# EAGLE schematic machine-controller (EAGLE 5.10)
WV: 10V

## Sheet 1 of 8
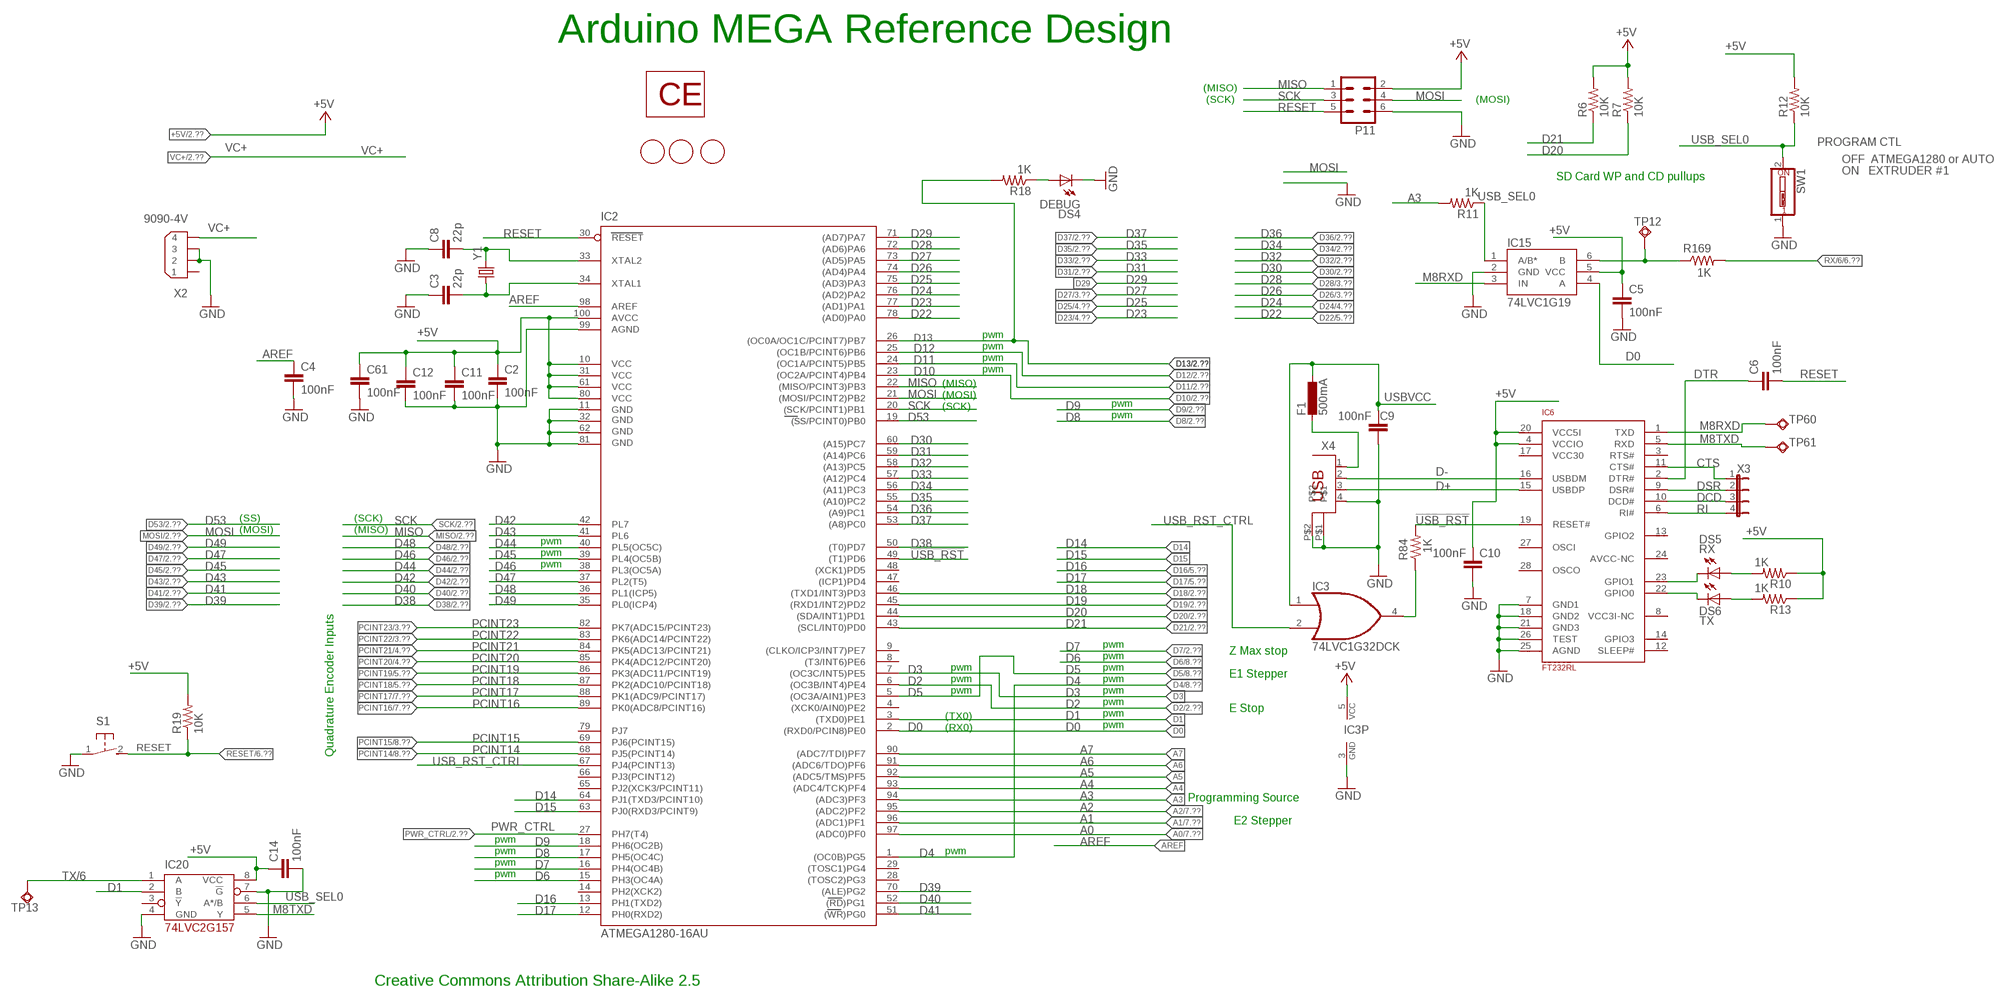
[diagram p0: schematic, sheet 1]

### Parts
C2  100nF  CAP0805  [0805]
C3  22p  CAP0805  [0805]
C4  100nF  CAP0805  [0805]
C5  100nF  CAP0805  [0805]
C6  100nF  CAP0805  [0805]
C8  22p  CAP0805  [0805]
C9  100nF  CAP0805  [0805]
C10  100nF  CAP0805  [0805]
C11  100nF  CAP0805  [0805]
C12  100nF  CAP0805  [0805]
C14  100nF  CAP0805  [0805]
C61  100nF  CAP0805  [0805]
DS4  DEBUG  LED0805  [LED-0805]
DS5  RX  LED0805  [LED-0805]
DS6  TX  LED0805  [LED-0805]
F1  500mA  L-EUL1812  [L1812]
IC2  ATMEGA1280-16AU  [TQFP100]
IC3  74LVC1G32DCK  [SC70-5]
IC6  FT232RL  [SSOP28]
IC15  74LVC1G19  [SC70-6]
IC20  74LVC2G157  [DCU_R-PDSO-G8]
P11  ML6  [ML6]
R6  10K  RESISTOR  [0805]
R7  10K  RESISTOR  [0805]
R10  1K  RESISTOR  [0805]
R11  1K  RESISTOR  [0805]
R12  10K  RESISTOR  [0805]
R13  1K  RESISTOR  [0805]
R18  1K  RESISTOR  [0805]
R19  10K  RESISTOR  [0805]
R84  1K  RESISTOR  [0805]
R169  1K  RESISTOR  [0805]
S1  31-XX  [B3F-31XX]
SW1  SW_DIP-1  [EDG-01]
TP12  TPSQTP09R  [TP09R]
TP13  TPSQTP09R  [TP09R]
TP60  TPSQTP09R  [TP09R]
TP61  TPSQTP09R  [TP09R]
U$3  FIDUCIALMOUNT  [FIDUCIA-MOUNT]
U$8  FIDUCIALMOUNT  [FIDUCIA-MOUNT]
U$9  FIDUCIALMOUNT  [FIDUCIA-MOUNT]
U$10  CE  [CE-COPPER]
X2  9090-4V  [9090-4V]
X3  JP4E  [JP4]
X4  PN61729  [PN61729]
Y1  CRYSTALHC49UP  [HC49UP]

### Nets
!USB_RST: IC2.49((T1)PD6) IC6.19(RESET#) R84.2
+5V [5V_power]: C2.1 C5.1 C10.2 C11.1 C12.1 C14.1 C61.1 IC2.10(VCC) IC2.31(VCC1) IC2.61(VCC2) IC2.80(VCC3) IC2.100(AVCC) IC3.5(VCC) IC6.4(VCCIO) IC6.20(VCC5I) IC15.5(VCC) IC20.8(VCC) P11.2 R6.2 R7.2 R10.1 R12.2 R13.1 R19.2 ; also sheet 2,3,4,5,6,7,8
A0: IC2.97((ADC0)PF0) ; also sheet 7
A1: IC2.96((ADC1)PF1) ; also sheet 7
A2: IC2.95((ADC2)PF2) ; also sheet 7
A3: IC2.94((ADC3)PF3) R11.2
A4: IC2.93((ADC4/TCK)PF4)
A5: IC2.92((ADC5/TMS)PF5)
A6: IC2.91((ADC6/TDO)PF6)
A7: IC2.90((ADC7/TDI)PF7)
AREF: C4.1 IC2.98(AREF)
CTS: IC6.11(CTS#) X3.1
D0: IC2.2((RXD0/PCIN8)PE0) IC15.4(A)
D1: IC2.3((TXD0)PE1) IC20.2(B)
D2: IC2.6((OC3B/INT4)PE4) ; also sheet 2
D3: IC2.7((OC3C/INT5)PE5)
D4: IC2.1((OC0B)PG5) ; also sheet 8
D5: IC2.5((OC3A/AIN1)PE3) ; also sheet 8
D6: IC2.15(PH3(OC4A)) ; also sheet 8
D7: IC2.16(PH4(OC4B)) ; also sheet 2
D8: IC2.17(PH5(OC4C)) ; also sheet 2
D9: IC2.18(PH6(OC2B)) ; also sheet 2
D10: IC2.23((OC2A/PCINT4)PB4) ; also sheet 2
D11: IC2.24((OC1A/PCINT5)PB5) ; also sheet 2
D12: IC2.25((OC1B/PCINT6)PB6) ; also sheet 2
D13: IC2.26((OC0A/OC1C/PCINT7)PB7) R18.2 ; also sheet 2
D14: IC2.64(PJ1(TXD3/PCINT10))
D15: IC2.63(PJ0(RXD3/PCINT9))
D16: IC2.13(PH1(TXD2)) ; also sheet 5
D17: IC2.12(PH0(RXD2)) ; also sheet 5
D18: IC2.46((TXD1/INT3)PD3) ; also sheet 2
D19: IC2.45((RXD1/INT2)PD2) ; also sheet 2
D20: IC2.44((SDA/INT1)PD1) R7.1 ; also sheet 2
D21: IC2.43((SCL/INT0)PD0) R6.1 ; also sheet 2
D22: IC2.78((AD0)PA0) ; also sheet 5
D23: IC2.77((AD1)PA1) ; also sheet 4
D24: IC2.76((AD2)PA2) ; also sheet 4
D25: IC2.75((AD3)PA3) ; also sheet 4
D26: IC2.74((AD4)PA4) ; also sheet 3
D27: IC2.73((AD5)PA5) ; also sheet 3
D28: IC2.72((AD6)PA6) ; also sheet 3
D29: IC2.71((AD7)PA7)
D30: IC2.60((A15)PC7) ; also sheet 2
D31: IC2.59((A14)PC6) ; also sheet 2
D32: IC2.58((A13)PC5) ; also sheet 2
D33: IC2.57((A12)PC4) ; also sheet 2
D34: IC2.56((A11)PC3) ; also sheet 2
D35: IC2.55((A10)PC2) ; also sheet 2
D36: IC2.54((A9)PC1) ; also sheet 2
D37: IC2.53((A8)PC0) ; also sheet 2
D38: IC2.50((T0)PD7) ; also sheet 2
D39: IC2.70((ALE)PG2) ; also sheet 2
D40: IC2.52((RD)PG1) ; also sheet 2
D41: IC2.51((WR)PG0) ; also sheet 2
D42: IC2.42(PL7) ; also sheet 2
D43: IC2.41(PL6) ; also sheet 2
D44: IC2.40(PL5(OC5C)) ; also sheet 2
D45: IC2.39(PL4(OC5B)) ; also sheet 2
D46: IC2.38(PL3(OC5A)) ; also sheet 2
D47: IC2.37(PL2(T5)) ; also sheet 2
D48: IC2.36(PL1(ICP5)) ; also sheet 2
D49: IC2.35(PL0(ICP4)) ; also sheet 2
D53: IC2.19((SS/PCINT0)PB0) ; also sheet 2
D+: IC6.15(USBDP) X4.3
D-: IC6.16(USBDM) X4.2
DCD: IC6.10(DCD#) X3.3
DSR: IC6.9(DSR#) X3.2
DTR: C6.1 IC6.2(DTR#)
GND [power]: C2.2 C3.1 C4.2 C5.2 C8.1 C9.1 C10.1 C11.2 C12.2 C14.2 C61.2 DS4.C IC2.11(GND) IC2.32(GND1) IC2.62(GND2) IC2.81(GND3) IC2.99(AGND) IC3.3(GND) IC6.7(GND1) IC6.18(GND2) IC6.21(GND3) IC6.25(AGND) IC6.26(TEST) IC15.2(GND) IC20.4(GND) IC20.7(!G) P11.6 S1.1(P) SW1.1 X2.2 X2.3 X4.4 X4.P$1 X4.P$2 ; also sheet 2,3,4,5,6,7,8
M8RXD: IC6.1(TXD) IC15.3(IN) TP60.TP
M8TXD: IC6.5(RXD) IC20.5(Y) TP61.TP
MISO: IC2.22((MISO/PCINT3)PB3) P11.1 ; also sheet 2
MOSI: IC2.21((MOSI/PCINT2)PB2) P11.4 ; also sheet 2
N$6: C3.2 IC2.34(XTAL1) Y1.1
N$7: C8.2 IC2.33(XTAL2) Y1.2
N$8: DS4.A R18.1
N$15: DS5.C IC6.23(GPIO1)
N$53: DS6.C IC6.22(GPIO0)
N$54: DS5.A R10.2
N$55: DS6.A R13.2
N$60 [usbvcc]: F1.2 X4.1
N$84: IC3.4(O) R84.1
N$101: IC15.6(B) R169.1 TP12.TP
PCINT14: IC2.68(PJ5(PCINT14)) ; also sheet 8
PCINT15: IC2.69(PJ6(PCINT15)) ; also sheet 8
PCINT16: IC2.89(PK0(ADC8/PCINT16)) ; also sheet 7
PCINT17: IC2.88(PK1(ADC9/PCINT17)) ; also sheet 7
PCINT18: IC2.87(PK2(ADC10/PCINT18)) ; also sheet 5
PCINT19: IC2.86(PK3(ADC11/PCINT19)) ; also sheet 5
PCINT20: IC2.85(PK4(ADC12/PCINT20)) ; also sheet 4
PCINT21: IC2.84(PK5(ADC13/PCINT21)) ; also sheet 4
PCINT22: IC2.83(PK6(ADC14/PCINT22)) ; also sheet 3
PCINT23: IC2.82(PK7(ADC15/PCINT23)) ; also sheet 3
PWR_CTRL: IC2.27(PH7(T4)) ; also sheet 2
RESET: C6.2 IC2.30(RESET) P11.5 R19.1 S1.2(S) ; also sheet 6
RI: IC6.6(RI#) X3.4
RX/6: R169.2 ; also sheet 6
SCK: IC2.20((SCK/PCINT1)PB1) P11.3 ; also sheet 2
TX/6: IC20.1(A) TP13.TP ; also sheet 6
USB_RST_CTRL: IC2.67(PJ4(PCINT13)) IC3.2(I1)
USB_SEL0: IC15.1(A/B*) IC20.6(A*/B) R11.1 R12.1 SW1.2
USBVCC [usbvcc]: C9.2 F1.1 IC3.1(I0)
VC+ [12V_power]: X2.4 ; also sheet 2,3,4,5,6,7,8
Unconnected: IC2.4((XCK0/AIN0)PE2) IC2.8((T3/INT6)PE6) IC2.9((CLKO/ICP3/INT7)PE7) IC2.14(PH2(XCK2)) IC2.28((TOSC2)PG3) IC2.29((TOSC1)PG4) IC2.47((ICP1)PD4) IC2.48((XCK1)PD5) IC2.65(PJ2(XCK3/PCINT11)) IC2.66(PJ3(PCINT12)) IC2.79(PJ7) IC6.3(RTS#) IC6.8(VCC3I-NC) IC6.12(SLEEP#) IC6.13(GPIO2) IC6.14(GPIO3) IC6.24(AVCC-NC) IC6.27(OSCI) IC6.28(OSCO) IC20.3(!Y) X2.1

### Notes on the sheet
- Arduino MEGA Reference Design
- (MISO)
- (SCK) | (MOSI)
- PROGRAM CTL
- OFF  ATMEGA1280 or AUTO
- ON   EXTRUDER #1
- SD Card WP and CD pullups
- pwm
- pwm
- pwm
- pwm
- (MISO)
- (MOSI)
- (SCK) | pwm
- pwm
- (SS) | (SCK)
- (MOSI) | (MISO)
- pwm
- pwm
- pwm
- pwm
- Z Max stop
- pwm
- pwm | pwm
- E1 Stepper
- pwm | pwm
- pwm | pwm
- pwm
- E Stop
- (TX0) | pwm
- (RX0) | pwm
- Quadrature Encoder Inputs
- Programming Source
- E2 Stepper
- pwm
- pwm | pwm
- pwm
- pwm
- Creative Commons Attribution Share-Alike 2.5

## Sheet 2 of 8
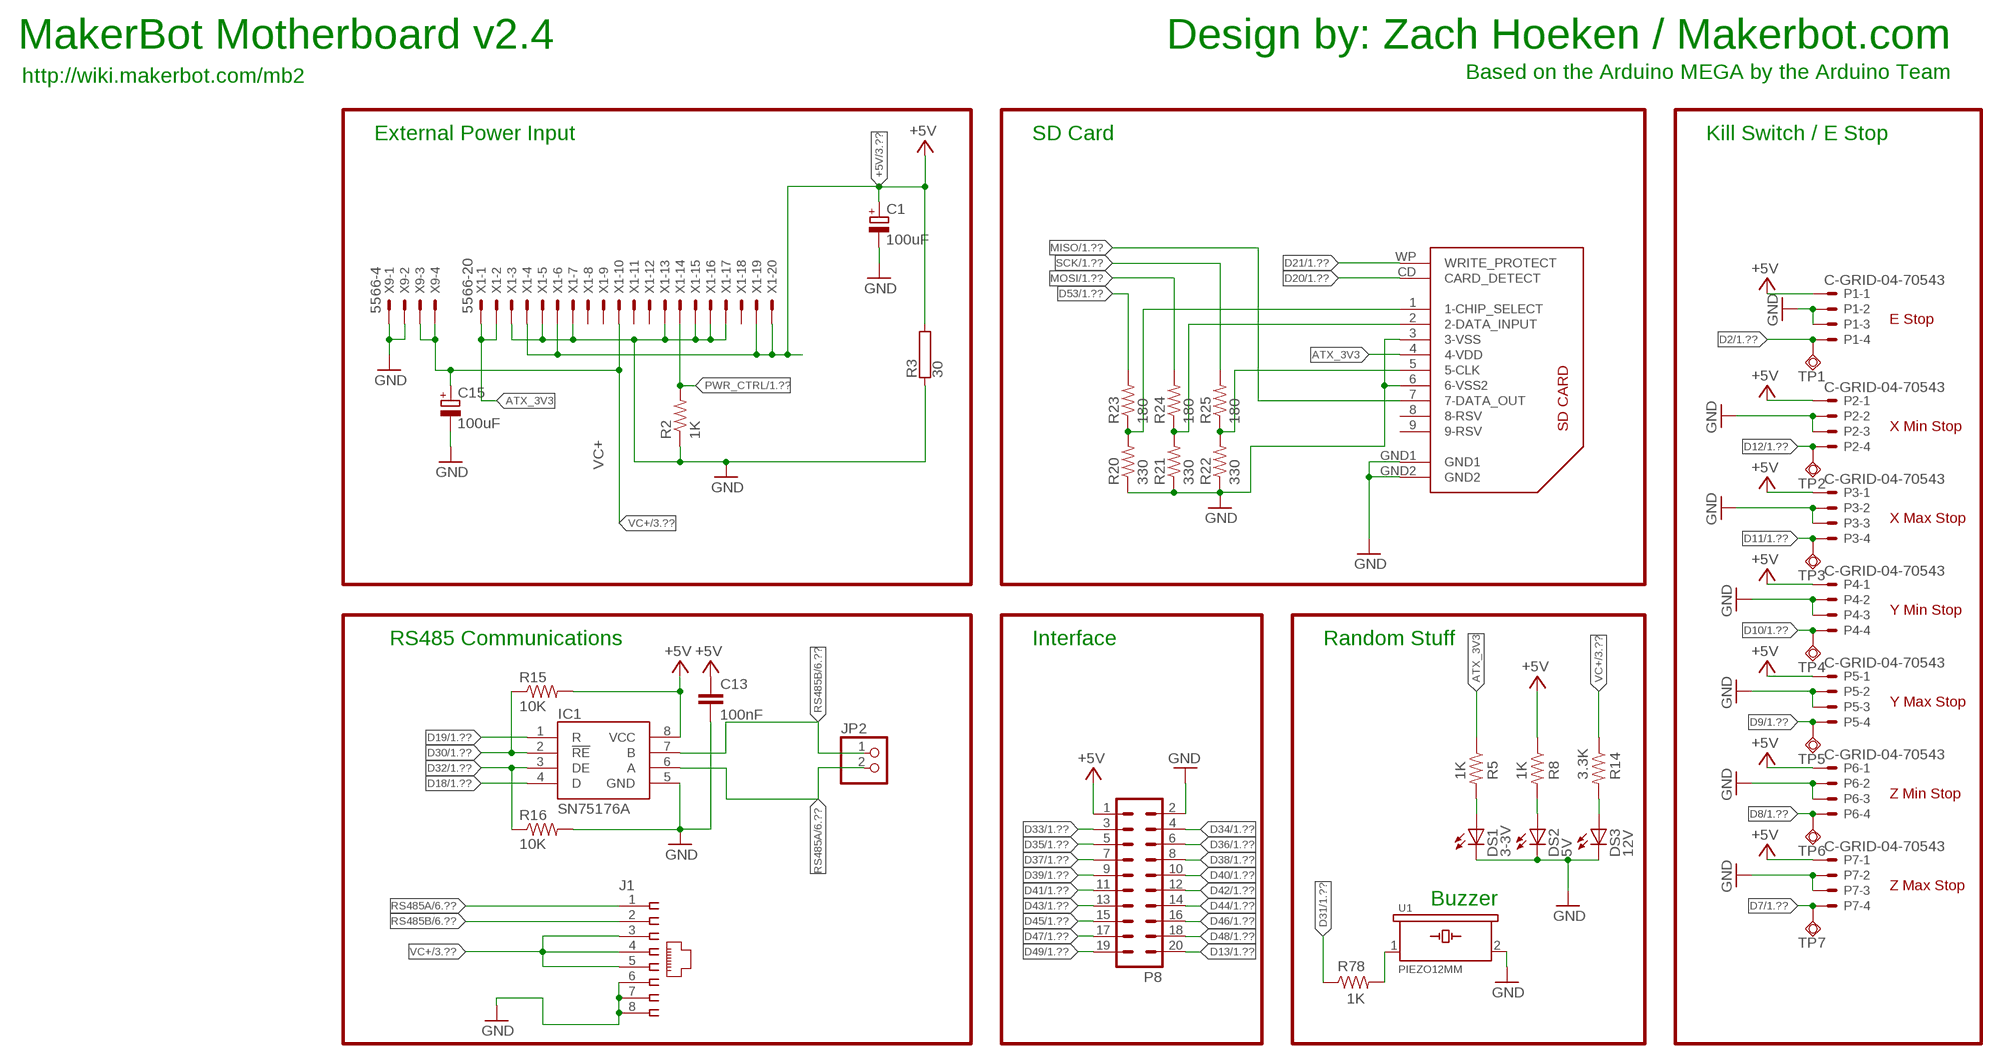
[diagram p1: schematic, sheet 2]

### Parts
C1  100uF  CPOL-EUE3.5-8  [E3,5-8]
C13  100nF  CAP0805  [0805]
C15  100uF  CPOL-EUE3.5-8  [E3,5-8]
DS1  3-3V  LED0805  [LED-0805]
DS2  5V  LED0805  [LED-0805]
DS3  12V  LED0805  [LED-0805]
IC1  SN75176A  SN75176ASOIC  [SO08]
J1  556416-1  [556416-1]
JP2  PINHD-1X2  [1X02]
P1  C-GRID-04-70543  [70543-04]
P2  C-GRID-04-70543  [70543-04]
P3  C-GRID-04-70543  [70543-04]
P4  C-GRID-04-70543  [70543-04]
P5  C-GRID-04-70543  [70543-04]
P6  C-GRID-04-70543  [70543-04]
P7  C-GRID-04-70543  [70543-04]
P8  ML20  [ML20]
R2  1K  RESISTOR  [0805]
R3  30  RKH206-8  [KH206-8]
R5  1K  RESISTOR  [0805]
R8  1K  RESISTOR  [0805]
R14  3.3K  RESISTOR  [0805]
R15  10K  RESISTOR  [0805]
R16  10K  RESISTOR  [0805]
R20  330  RESISTOR  [0805]
R21  330  RESISTOR  [0805]
R22  330  RESISTOR  [0805]
R23  180  RESISTOR  [0805]
R24  180  RESISTOR  [0805]
R25  180  RESISTOR  [0805]
R78  1K  RESISTOR  [0805]
TP1  TPSQTP09R  [TP09R]
TP2  TPSQTP09R  [TP09R]
TP3  TPSQTP09R  [TP09R]
TP4  TPSQTP09R  [TP09R]
TP5  TPSQTP09R  [TP09R]
TP6  TPSQTP09R  [TP09R]
TP7  TPSQTP09R  [TP09R]
U1  PIEZO12MM  [AUDIO12MM]
U$13  SDCARD  [3M-SDCARD]
X1  5566-20  [5566-20]
X9  5566-4  [5566-4]

### Nets
+5V [5V_power]: C1.+ C13.1 IC1.8(VCC) P1.1 P2.1 P3.1 P4.1 P5.1 P6.1 P7.1 P8.1 R3.2 R8.1 R15.2 X1.4 X1.6 X1.19 X1.20 ; also sheet 1,3,4,5,6,7,8
ATX_3V3: R5.1 U$13.4(4-VDD) X1.1 X1.2
D2: P1.4 TP1.TP ; also sheet 1
D7: P7.4 TP7.TP ; also sheet 1
D8: P6.4 TP6.TP ; also sheet 1
D9: P5.4 TP5.TP ; also sheet 1
D10: P4.4 TP4.TP ; also sheet 1
D11: P3.4 TP3.TP ; also sheet 1
D12: P2.4 TP2.TP ; also sheet 1
D13: P8.20 ; also sheet 1
D18: IC1.4(D) ; also sheet 1
D19: IC1.1(R) ; also sheet 1
D20: U$13.CD(CARD_DETECT) ; also sheet 1
D21: U$13.WP(WRITE_PROTECT) ; also sheet 1
D30: IC1.2(!RE) R15.1 ; also sheet 1
D31: R78.1 ; also sheet 1
D32: IC1.3(DE) R16.1 ; also sheet 1
D33: P8.3 ; also sheet 1
D34: P8.4 ; also sheet 1
D35: P8.5 ; also sheet 1
D36: P8.6 ; also sheet 1
D37: P8.7 ; also sheet 1
D38: P8.8 ; also sheet 1
D39: P8.9 ; also sheet 1
D40: P8.10 ; also sheet 1
D41: P8.11 ; also sheet 1
D42: P8.12 ; also sheet 1
D43: P8.13 ; also sheet 1
D44: P8.14 ; also sheet 1
D45: P8.15 ; also sheet 1
D46: P8.16 ; also sheet 1
D47: P8.17 ; also sheet 1
D48: P8.18 ; also sheet 1
D49: P8.19 ; also sheet 1
D53: R23.2 ; also sheet 1
GND [power]: C1.- C13.2 C15.- DS1.C DS2.C DS3.C IC1.5(GND) J1.6 J1.7 J1.8 P1.2 P1.3 P2.2 P2.3 P3.2 P3.3 P4.2 P4.3 P5.2 P5.3 P6.2 P6.3 P7.2 P7.3 P8.2 R2.1 R3.1 R16.2 R20.1 R21.1 R22.1 U1.2 U$13.3(3-VSS) U$13.6(6-VSS2) U$13.GND1 U$13.GND2 X1.3 X1.5 X1.7 X1.13 X1.15 X1.16 X1.17 X9.1 X9.2 ; also sheet 1,3,4,5,6,7,8
MISO: U$13.7(7-DATA_OUT) ; also sheet 1
MOSI: R24.2 ; also sheet 1
N$1: DS1.A R5.2
N$3: DS2.A R8.2
N$4: R22.2 R25.1 U$13.5(5-CLK)
N$5: R21.2 R24.1 U$13.2(2-DATA_INPUT)
N$10: DS3.A R14.2
N$11: R20.2 R23.1 U$13.1(1-CHIP_SELECT)
N$70: R78.2 U1.1
PWR_CTRL: R2.2 X1.14 ; also sheet 1
RS485A: IC1.6(A) J1.1 JP2.2 ; also sheet 6
RS485B: IC1.7(B) J1.2 JP2.1 ; also sheet 6
SCK: R25.2 ; also sheet 1
VC+ [12V_power]: C15.+ J1.3 J1.4 J1.5 R14.1 X1.10 X9.3 X9.4 ; also sheet 1,3,4,5,6,7,8
Unconnected: U$13.8(8-RSV) U$13.9(9-RSV) X1.8 X1.9 X1.11 X1.12 X1.18

### Notes on the sheet
- Design by: Zach Hoeken / Makerbot.com
- MakerBot Motherboard v2.4
- Based on the Arduino MEGA by the Arduino Team
- http://wiki.makerbot.com/mb2
- External Power Input | SD Card | Kill Switch / E Stop
- E Stop
- X Min Stop
- X Max Stop
- Y Min Stop
- RS485 Communications | Interface | Random Stuff
- Y Max Stop
- Z Min Stop
- Z Max Stop
- Buzzer

## Sheet 3 of 8
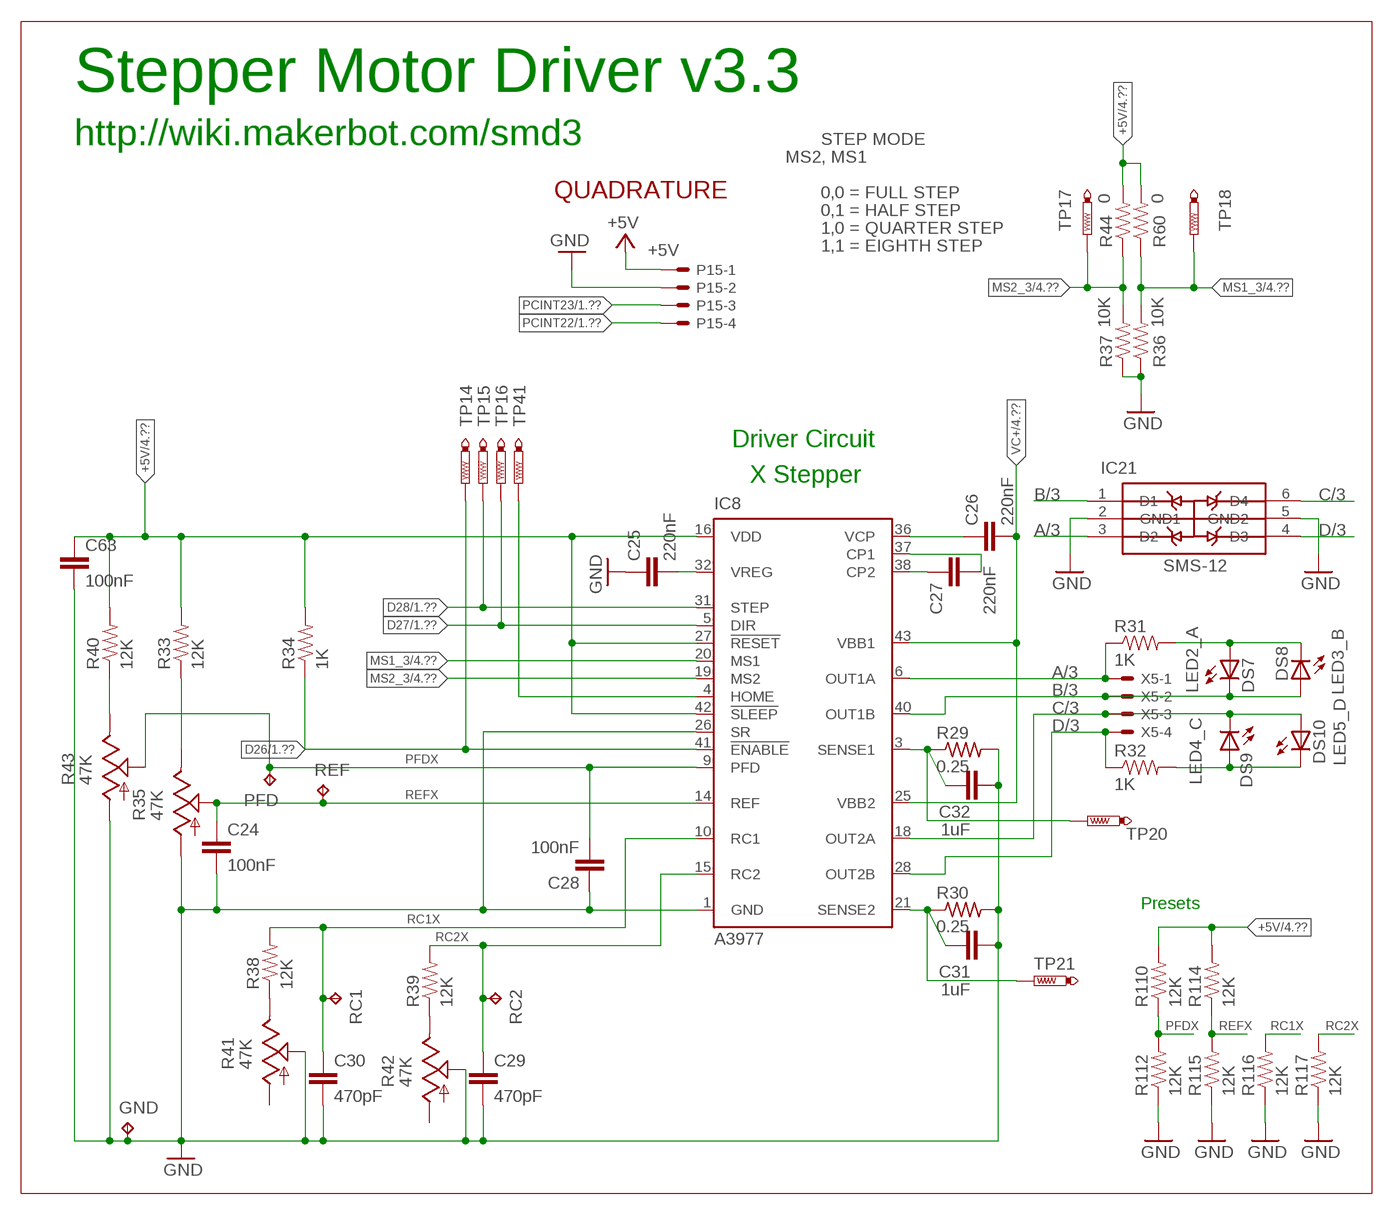
[diagram p2: schematic, sheet 3]

### Parts
C24  100nF  CAP0805  [0805]
C25  220nF  CAP0805  [0805]
C26  220nF  CAP0805  [0805]
C27  220nF  CAP0805  [0805]
C28  100nF  CAP0805  [0805]
C29  470pF  CAP0805  [0805]
C30  470pF  CAP0805  [0805]
C31  1uF  CAP0805  [0805]
C32  1uF  CAP0805  [0805]
C63  100nF  CAP0805  [0805]
DS7  LED2_A  LED0805  [LED-0805]
DS8  LED3_B  LED0805  [LED-0805]
DS9  LED4_C  LED0805  [LED-0805]
DS10  LED5_D  LED0805  [LED-0805]
GND  TPPAD1-13  [P1-13]
IC8  A3977  [PLCC44]
IC21  SMS-12  TVS-DIODE-ARRAY  [SOT23-6]
P15  C-GRID-04-70543  [70543-04]
PFD  TPPAD1-13  [P1-13]
R29  0.25  R-US_R2512  [R2512]
R30  0.25  R-US_R2512  [R2512]
R31  1K  RESISTOR  [0805]
R32  1K  RESISTOR  [0805]
R33  12K  RESISTOR  [0805]
R34  1K  RESISTOR  [0805]
R35  47K  TRIM_US-B25P  [B25P]
R36  10K  RESISTOR  [0805]
R37  10K  RESISTOR  [0805]
R38  12K  RESISTOR  [0805]
R39  12K  RESISTOR  [0805]
R40  12K  RESISTOR  [0805]
R41  47K  TRIM_US-B25P  [B25P]
R42  47K  TRIM_US-B25P  [B25P]
R43  47K  TRIM_US-B25P  [B25P]
R44  0  RESISTOR  [0805]
R60  0  RESISTOR  [0805]
R110  12K  RESISTOR  [0805]
R112  12K  RESISTOR  [0805]
R114  12K  RESISTOR  [0805]
R115  12K  RESISTOR  [0805]
R116  12K  RESISTOR  [0805]
R117  12K  RESISTOR  [0805]
RC1  TPPAD1-13  [P1-13]
RC2  TPPAD1-13  [P1-13]
REF  TPPAD1-13  [P1-13]
TP14  PTR1TP09R  [TP09R]
TP15  PTR1TP09R  [TP09R]
TP16  PTR1TP09R  [TP09R]
TP17  PTR1TP09R  [TP09R]
TP18  PTR1TP09R  [TP09R]
TP20  PTR1TP09R  [TP09R]
TP21  PTR1TP09R  [TP09R]
TP41  PTR1TP09R  [TP09R]
X5  KK-156-4  [KK-156-4]

### Nets
+5V [5V_power]: C63.1 IC8.16(VDD) IC8.27(!RESET) IC8.42(!SLEEP) P15.1 R33.2 R34.2 R40.2 R44.2 R60.2 R110.2 R114.2 ; also sheet 1,2,4,5,6,7,8
A/3 [power]: IC8.6(OUT1A) IC21.3(D2) R31.1 X5.1
B/3 [power]: DS7.C DS8.A IC8.40(OUT1B) IC21.1(D1) X5.2
C/3 [power]: DS9.C DS10.A IC8.18(OUT2A) IC21.6(D4) X5.3
D26: IC8.41(!ENABLE) R34.1 TP14.TP ; also sheet 1
D27: IC8.5(DIR) TP16.TP ; also sheet 1
D28: IC8.31(STEP) TP15.TP ; also sheet 1
D/3 [power]: IC8.28(OUT2B) IC21.4(D3) R32.1 X5.4
GND [power]: C24.2 C25.1 C28.1 C29.2 C30.2 C31.2 C32.2 C63.2 GND.TP IC8.1(GND) IC8.26(SR) IC21.2(GND1) IC21.5(GND2) P15.2 R29.2 R30.2 R35.A R36.1 R37.1 R41.S R42.S R43.A R112.1 R115.1 R116.1 R117.1 ; also sheet 1,2,4,5,6,7,8
MS1_3: IC8.20(MS1) R36.2 R60.1 TP18.TP ; also sheet 4
MS2_3: IC8.19(MS2) R37.2 R44.1 TP17.TP ; also sheet 4
N$14: DS7.A DS8.C R31.2
N$16: DS9.A DS10.C R32.2
N$17: R33.1 R35.E
N$18: C25.2 IC8.32(VREG)
N$19: C27.1 IC8.38(CP2)
N$20: C27.2 IC8.37(CP1)
N$21: C26.1 IC8.36(VCP)
N$22 [power]: C32.1 IC8.3(SENSE1) R29.1 TP20.TP
N$23 [power]: C31.1 IC8.21(SENSE2) R30.1 TP21.TP
N$25: R38.1 R41.E
N$26: R39.1 R42.E
N$29: R40.1 R43.E
N$77: IC8.4(HOME) TP41.TP
PCINT22: P15.4 ; also sheet 1
PCINT23: P15.3 ; also sheet 1
PFDX: C28.2 IC8.9(PFD) PFD.TP R43.S R110.1 R112.2
RC1X: C30.1 IC8.10(RC1) R38.2 R116.2 RC1.TP
RC2X: C29.1 IC8.15(RC2) R39.2 R117.2 RC2.TP
REFX: C24.1 IC8.14(REF) R35.S R114.1 R115.2 REF.TP
VC+ [12V_power]: C26.2 IC8.25(VBB2) IC8.43(VBB1) ; also sheet 1,2,4,5,6,7,8
Unconnected: R41.A R42.A

### Notes on the sheet
- Stepper Motor Driver v3.3
- http://wiki.makerbot.com/smd3 | STEP MODE
- MS2, MS1
- QUADRATURE | 0,0 = FULL STEP
- 0,1 = HALF STEP
- 1,0 = QUARTER STEP
- 1,1 = EIGHTH STEP
- Driver Circuit
- X Stepper
- Presets

## Sheet 4 of 8
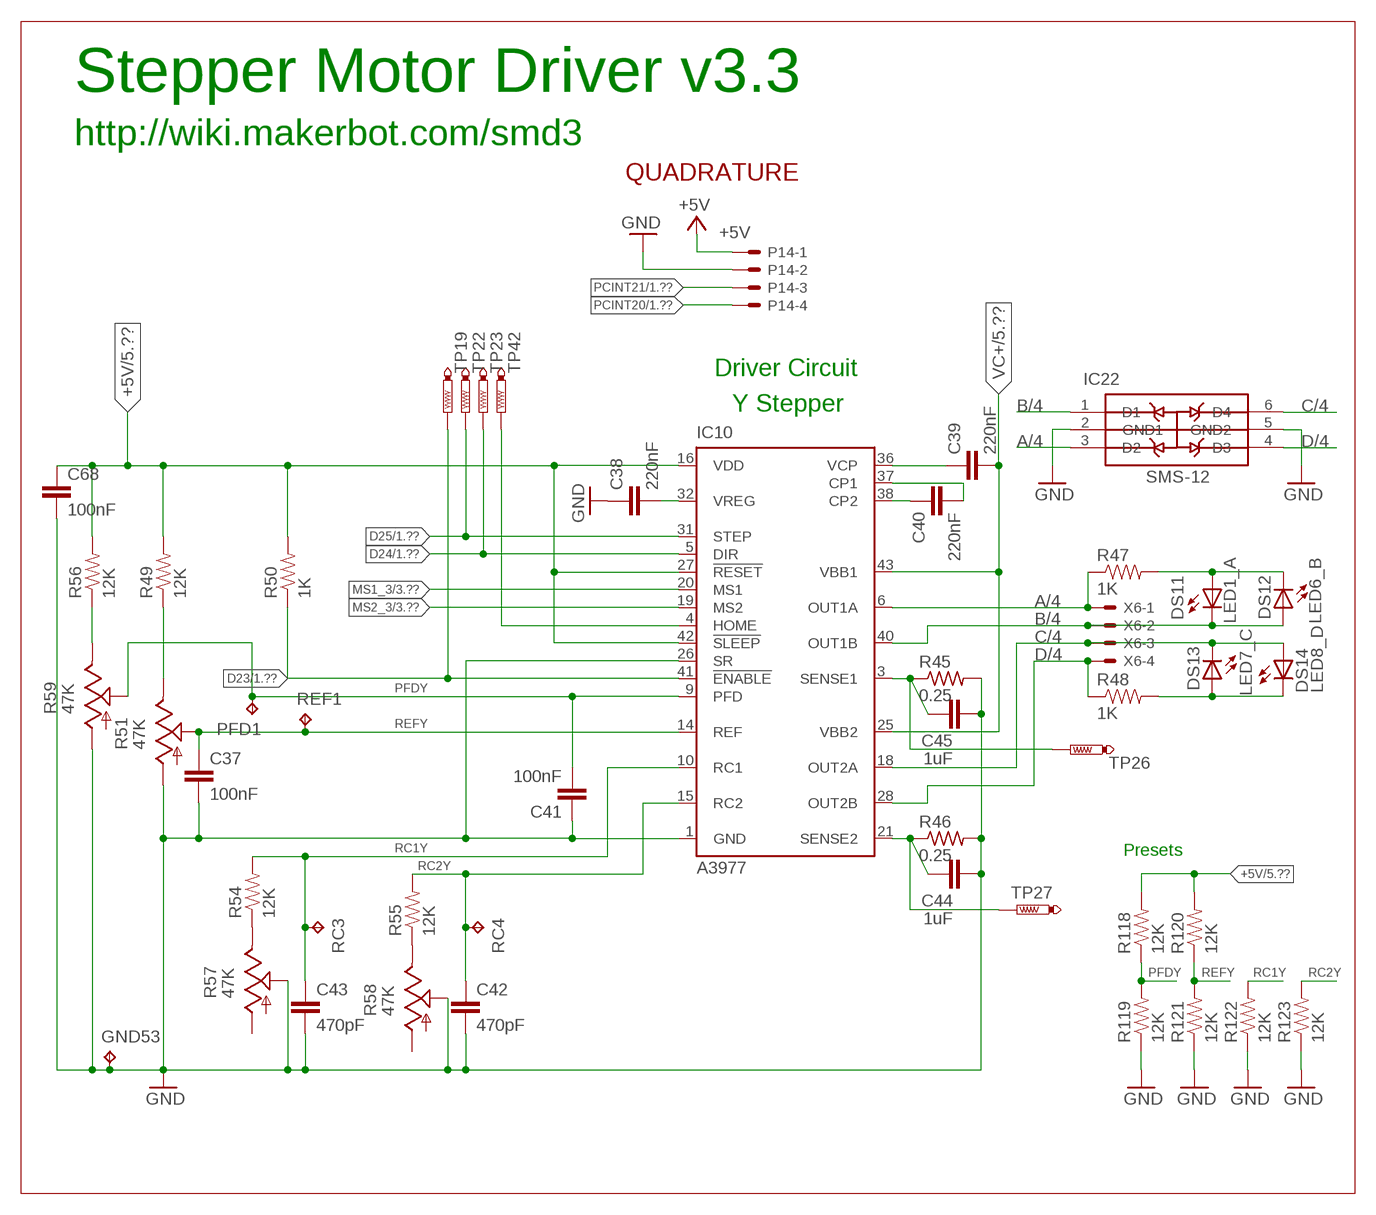
[diagram p3: schematic, sheet 4]

### Parts
C37  100nF  CAP0805  [0805]
C38  220nF  CAP0805  [0805]
C39  220nF  CAP0805  [0805]
C40  220nF  CAP0805  [0805]
C41  100nF  CAP0805  [0805]
C42  470pF  CAP0805  [0805]
C43  470pF  CAP0805  [0805]
C44  1uF  CAP0805  [0805]
C45  1uF  CAP0805  [0805]
C68  100nF  CAP0805  [0805]
DS11  LED1_A  LED0805  [LED-0805]
DS12  LED6_B  LED0805  [LED-0805]
DS13  LED7_C  LED0805  [LED-0805]
DS14  LED8_D  LED0805  [LED-0805]
GND53  TPPAD1-13  [P1-13]
IC10  A3977  [PLCC44]
IC22  SMS-12  TVS-DIODE-ARRAY  [SOT23-6]
P14  C-GRID-04-70543  [70543-04]
PFD1  TPPAD1-13  [P1-13]
R45  0.25  R-US_R2512  [R2512]
R46  0.25  R-US_R2512  [R2512]
R47  1K  RESISTOR  [0805]
R48  1K  RESISTOR  [0805]
R49  12K  RESISTOR  [0805]
R50  1K  RESISTOR  [0805]
R51  47K  TRIM_US-B25P  [B25P]
R54  12K  RESISTOR  [0805]
R55  12K  RESISTOR  [0805]
R56  12K  RESISTOR  [0805]
R57  47K  TRIM_US-B25P  [B25P]
R58  47K  TRIM_US-B25P  [B25P]
R59  47K  TRIM_US-B25P  [B25P]
R118  12K  RESISTOR  [0805]
R119  12K  RESISTOR  [0805]
R120  12K  RESISTOR  [0805]
R121  12K  RESISTOR  [0805]
R122  12K  RESISTOR  [0805]
R123  12K  RESISTOR  [0805]
RC3  TPPAD1-13  [P1-13]
RC4  TPPAD1-13  [P1-13]
REF1  TPPAD1-13  [P1-13]
TP19  PTR1TP09R  [TP09R]
TP22  PTR1TP09R  [TP09R]
TP23  PTR1TP09R  [TP09R]
TP26  PTR1TP09R  [TP09R]
TP27  PTR1TP09R  [TP09R]
TP42  PTR1TP09R  [TP09R]
X6  KK-156-4  [KK-156-4]

### Nets
+5V [5V_power]: C68.1 IC10.16(VDD) IC10.27(!RESET) IC10.42(!SLEEP) P14.1 R49.2 R50.2 R56.2 R118.2 R120.2 ; also sheet 1,2,3,5,6,7,8
A/4 [power]: IC10.6(OUT1A) IC22.3(D2) R47.1 X6.1
B/4 [power]: DS11.C DS12.A IC10.40(OUT1B) IC22.1(D1) X6.2
C/4 [power]: DS13.C DS14.A IC10.18(OUT2A) IC22.6(D4) X6.3
D23: IC10.41(!ENABLE) R50.1 TP19.TP ; also sheet 1
D24: IC10.5(DIR) TP23.TP ; also sheet 1
D25: IC10.31(STEP) TP22.TP ; also sheet 1
D/4 [power]: IC10.28(OUT2B) IC22.4(D3) R48.1 X6.4
GND [power]: C37.2 C38.1 C41.1 C42.2 C43.2 C44.2 C45.2 C68.2 GND53.TP IC10.1(GND) IC10.26(SR) IC22.2(GND1) IC22.5(GND2) P14.2 R45.2 R46.2 R51.A R57.S R58.S R59.A R119.1 R121.1 R122.1 R123.1 ; also sheet 1,2,3,5,6,7,8
MS1_3: IC10.20(MS1) ; also sheet 3
MS2_3: IC10.19(MS2) ; also sheet 3
N$32: DS11.A DS12.C R47.2
N$33: DS13.A DS14.C R48.2
N$34: R49.1 R51.E
N$35: C38.2 IC10.32(VREG)
N$36: C40.1 IC10.38(CP2)
N$37: C40.2 IC10.37(CP1)
N$38: C39.1 IC10.36(VCP)
N$39 [power]: C45.1 IC10.3(SENSE1) R45.1 TP26.TP
N$40 [power]: C44.1 IC10.21(SENSE2) R46.1 TP27.TP
N$42: R54.1 R57.E
N$43: R55.1 R58.E
N$46: R56.1 R59.E
N$78: IC10.4(HOME) TP42.TP
PCINT20: P14.4 ; also sheet 1
PCINT21: P14.3 ; also sheet 1
PFDY: C41.2 IC10.9(PFD) PFD1.TP R59.S R118.1 R119.2
RC1Y: C43.1 IC10.10(RC1) R54.2 R122.2 RC3.TP
RC2Y: C42.1 IC10.15(RC2) R55.2 R123.2 RC4.TP
REFY: C37.1 IC10.14(REF) R51.S R120.1 R121.2 REF1.TP
VC+ [12V_power]: C39.2 IC10.25(VBB2) IC10.43(VBB1) ; also sheet 1,2,3,5,6,7,8
Unconnected: R57.A R58.A

### Notes on the sheet
- Stepper Motor Driver v3.3
- http://wiki.makerbot.com/smd3
- QUADRATURE
- Driver Circuit
- Y Stepper
- Presets

## Sheet 5 of 8
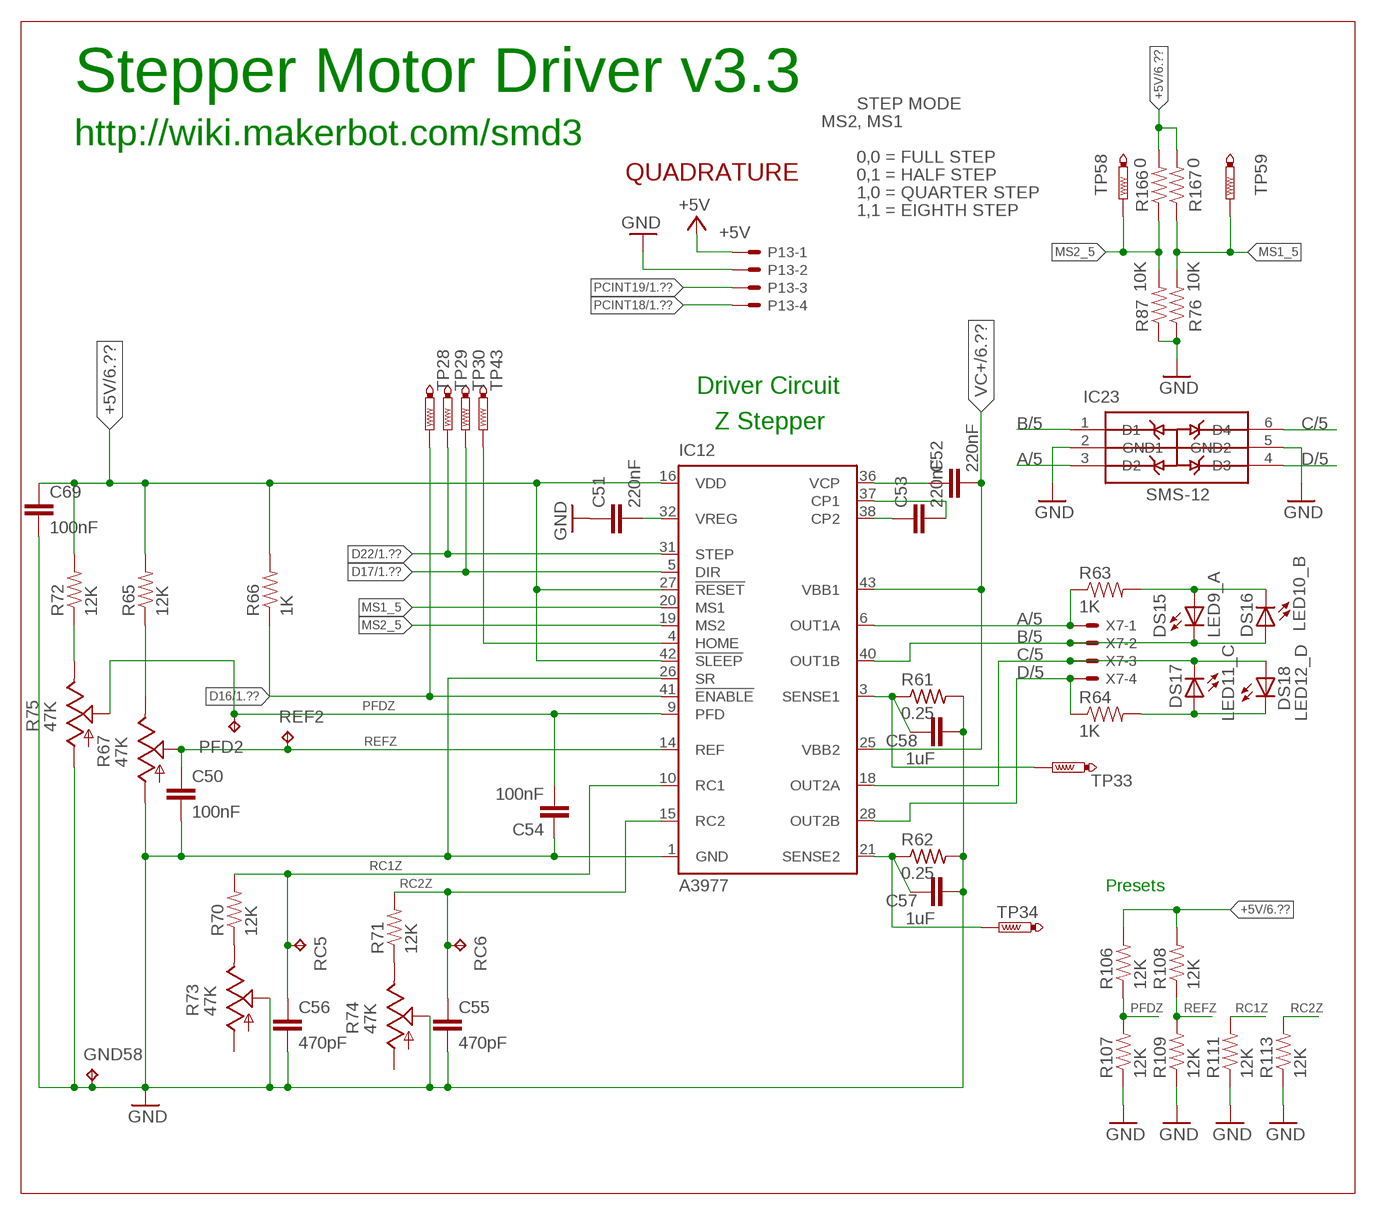
[diagram p4: schematic, sheet 5]

### Parts
C50  100nF  CAP0805  [0805]
C51  220nF  CAP0805  [0805]
C52  220nF  CAP0805  [0805]
C53  220nF  CAP0805  [0805]
C54  100nF  CAP0805  [0805]
C55  470pF  CAP0805  [0805]
C56  470pF  CAP0805  [0805]
C57  1uF  CAP0805  [0805]
C58  1uF  CAP0805  [0805]
C69  100nF  CAP0805  [0805]
DS15  LED9_A  LED0805  [LED-0805]
DS16  LED10_B  LED0805  [LED-0805]
DS17  LED11_C  LED0805  [LED-0805]
DS18  LED12_D  LED0805  [LED-0805]
GND58  TPPAD1-13  [P1-13]
IC12  A3977  [PLCC44]
IC23  SMS-12  TVS-DIODE-ARRAY  [SOT23-6]
P13  C-GRID-04-70543  [70543-04]
PFD2  TPPAD1-13  [P1-13]
R61  0.25  R-US_R2512  [R2512]
R62  0.25  R-US_R2512  [R2512]
R63  1K  RESISTOR  [0805]
R64  1K  RESISTOR  [0805]
R65  12K  RESISTOR  [0805]
R66  1K  RESISTOR  [0805]
R67  47K  TRIM_US-B25P  [B25P]
R70  12K  RESISTOR  [0805]
R71  12K  RESISTOR  [0805]
R72  12K  RESISTOR  [0805]
R73  47K  TRIM_US-B25P  [B25P]
R74  47K  TRIM_US-B25P  [B25P]
R75  47K  TRIM_US-B25P  [B25P]
R76  10K  RESISTOR  [0805]
R87  10K  RESISTOR  [0805]
R106  12K  RESISTOR  [0805]
R107  12K  RESISTOR  [0805]
R108  12K  RESISTOR  [0805]
R109  12K  RESISTOR  [0805]
R111  12K  RESISTOR  [0805]
R113  12K  RESISTOR  [0805]
R166  0  RESISTOR  [0805]
R167  0  RESISTOR  [0805]
RC5  TPPAD1-13  [P1-13]
RC6  TPPAD1-13  [P1-13]
REF2  TPPAD1-13  [P1-13]
TP28  PTR1TP09R  [TP09R]
TP29  PTR1TP09R  [TP09R]
TP30  PTR1TP09R  [TP09R]
TP33  PTR1TP09R  [TP09R]
TP34  PTR1TP09R  [TP09R]
TP43  PTR1TP09R  [TP09R]
TP58  PTR1TP09R  [TP09R]
TP59  PTR1TP09R  [TP09R]
X7  KK-156-4  [KK-156-4]

### Nets
+5V [5V_power]: C69.1 IC12.16(VDD) IC12.27(!RESET) IC12.42(!SLEEP) P13.1 R65.2 R66.2 R72.2 R106.2 R108.2 R166.2 R167.2 ; also sheet 1,2,3,4,6,7,8
A/5 [power]: IC12.6(OUT1A) IC23.3(D2) R63.1 X7.1
B/5 [power]: DS15.C DS16.A IC12.40(OUT1B) IC23.1(D1) X7.2
C/5 [power]: DS17.C DS18.A IC12.18(OUT2A) IC23.6(D4) X7.3
D16: IC12.41(!ENABLE) R66.1 TP28.TP ; also sheet 1
D17: IC12.5(DIR) TP30.TP ; also sheet 1
D22: IC12.31(STEP) TP29.TP ; also sheet 1
D/5 [power]: IC12.28(OUT2B) IC23.4(D3) R64.1 X7.4
GND [power]: C50.2 C51.1 C54.1 C55.2 C56.2 C57.2 C58.2 C69.2 GND58.TP IC12.1(GND) IC12.26(SR) IC23.2(GND1) IC23.5(GND2) P13.2 R61.2 R62.2 R67.A R73.S R74.S R75.A R76.1 R87.1 R107.1 R109.1 R111.1 R113.1 ; also sheet 1,2,3,4,6,7,8
MS1_5: IC12.20(MS1) R76.2 R167.1 TP59.TP
MS2_5: IC12.19(MS2) R87.2 R166.1 TP58.TP
N$49: DS15.A DS16.C R63.2
N$50: DS17.A DS18.C R64.2
N$51: R65.1 R67.E
N$52: C51.2 IC12.32(VREG)
N$56: C53.1 IC12.38(CP2)
N$57: C53.2 IC12.37(CP1)
N$58: C52.1 IC12.36(VCP)
N$59 [power]: C58.1 IC12.3(SENSE1) R61.1 TP33.TP
N$61 [power]: C57.1 IC12.21(SENSE2) R62.1 TP34.TP
N$63: R70.1 R73.E
N$64: R71.1 R74.E
N$67: R72.1 R75.E
N$82: IC12.4(HOME) TP43.TP
PCINT18: P13.4 ; also sheet 1
PCINT19: P13.3 ; also sheet 1
PFDZ: C54.2 IC12.9(PFD) PFD2.TP R75.S R106.1 R107.2
RC1Z: C56.1 IC12.10(RC1) R70.2 R111.2 RC5.TP
RC2Z: C55.1 IC12.15(RC2) R71.2 R113.2 RC6.TP
REFZ: C50.1 IC12.14(REF) R67.S R108.1 R109.2 REF2.TP
VC+ [12V_power]: C52.2 IC12.25(VBB2) IC12.43(VBB1) ; also sheet 1,2,3,4,6,7,8
Unconnected: R73.A R74.A

### Notes on the sheet
- Stepper Motor Driver v3.3
- STEP MODE
- MS2, MS1
- http://wiki.makerbot.com/smd3
- 0,0 = FULL STEP
- QUADRATURE | 0,1 = HALF STEP
- 1,0 = QUARTER STEP
- 1,1 = EIGHTH STEP
- Driver Circuit
- Z Stepper
- Presets

## Sheet 6 of 8
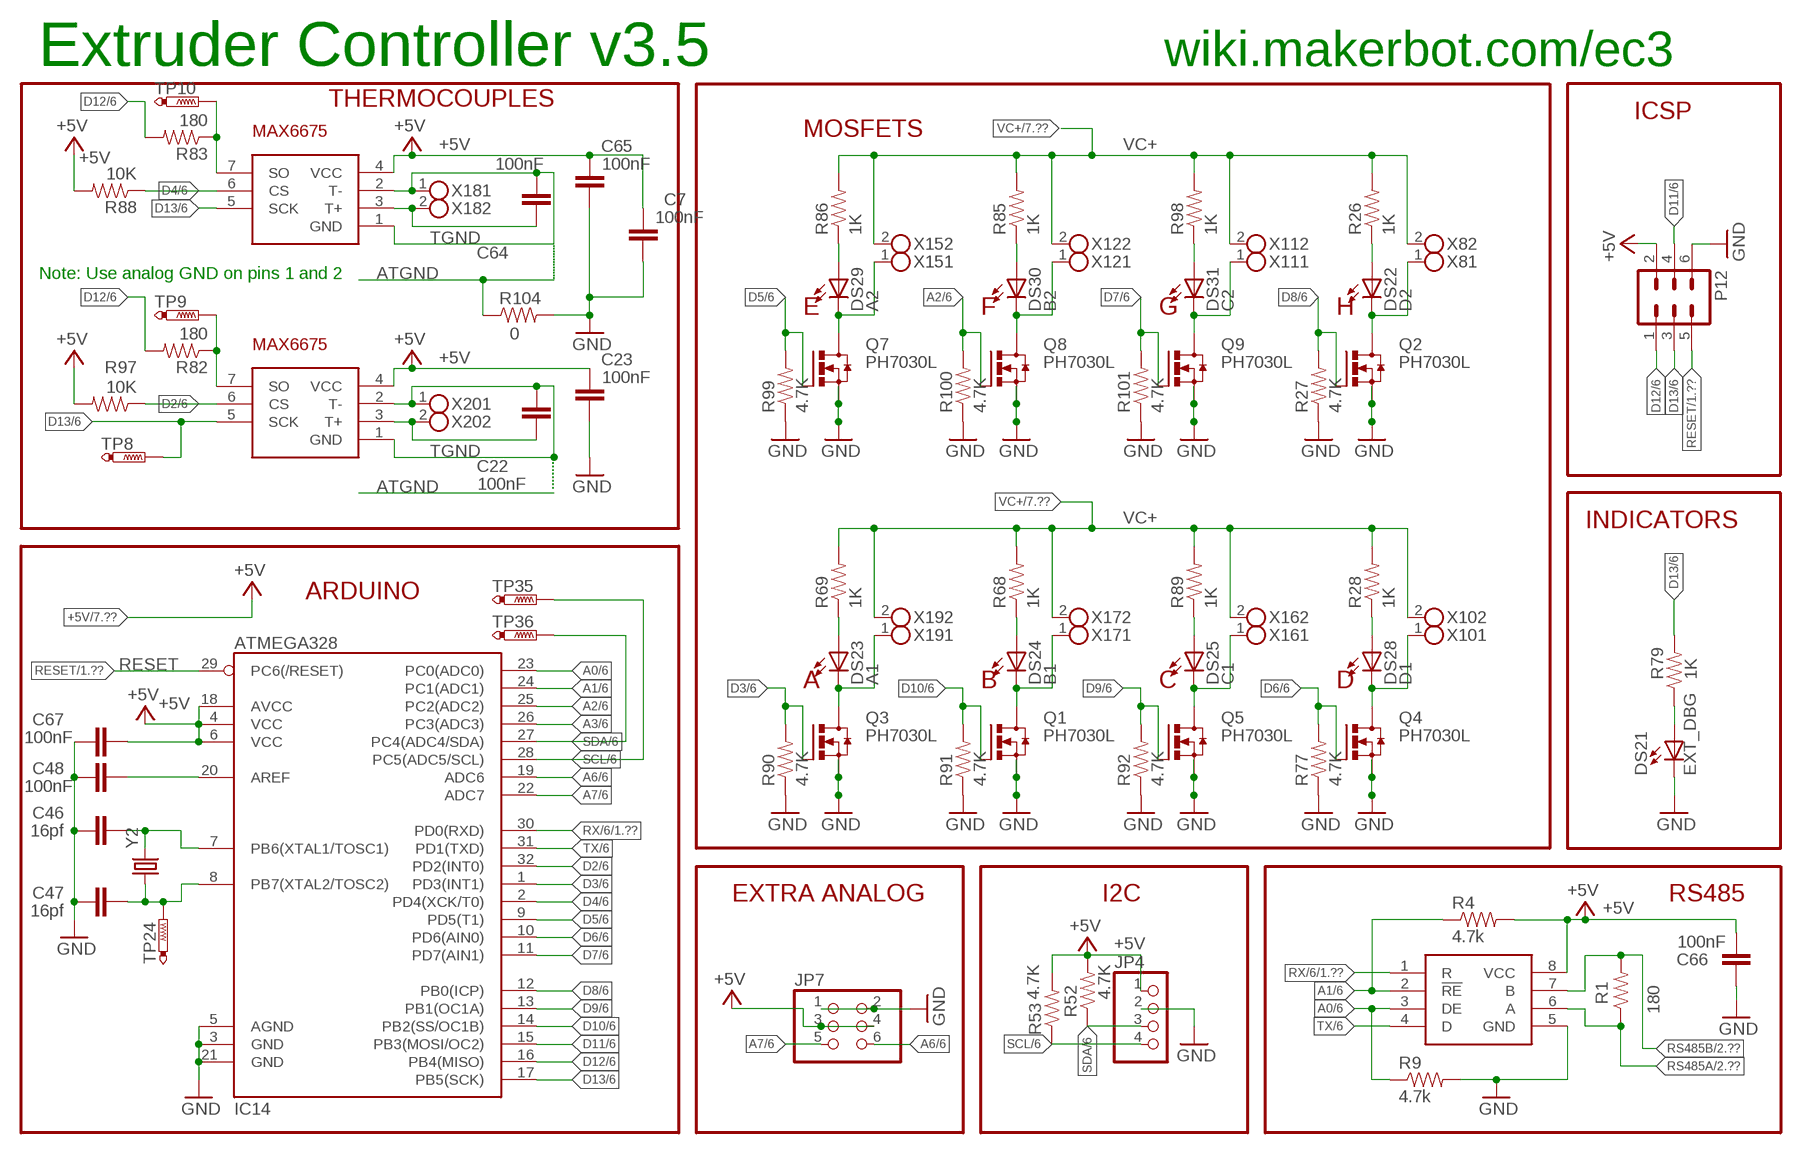
[diagram p5: schematic, sheet 6]

### Parts
C7  100nF  CAP0805  [0805]
C22  100nF  CAP0805  [0805]
C23  100nF  CAP0805  [0805]
C46  16pf  CAP0805  [0805]
C47  16pf  CAP0805  [0805]
C48  100nF  CAP0805  [0805]
C64  100nF  CAP0805  [0805]
C65  100nF  CAP0805  [0805]
C66  100nF  CAP0805  [0805]
C67  100nF  CAP0805  [0805]
DS21  EXT_DBG  LED0805  [LED-0805]
DS22  D2  LED0805  [LED-0805]
DS23  A1  LED0805  [LED-0805]
DS24  B1  LED0805  [LED-0805]
DS25  C1  LED0805  [LED-0805]
DS28  D1  LED0805  [LED-0805]
DS29  A2  LED0805  [LED-0805]
DS30  B2  LED0805  [LED-0805]
DS31  C2  LED0805  [LED-0805]
IC9  MAX6675  [SO08]
IC11  SN75176ASOIC  [SO08]
IC14  ATMEGA328  ATMEGA168  [TQFP32-08]
IC17  MAX6675  [SO08]
JP4  PINHD-1X4  [1X04]
JP7  PINHD-2X3  [2X03]
P12  ML6  [ML6]
Q1  PH7030L  [SOT669]
Q2  PH7030L  [SOT669]
Q3  PH7030L  [SOT669]
Q4  PH7030L  [SOT669]
Q5  PH7030L  [SOT669]
Q7  PH7030L  [SOT669]
Q8  PH7030L  [SOT669]
Q9  PH7030L  [SOT669]
R1  180  RESISTOR  [0805]
R4  4.7k  RESISTOR  [0805]
R9  4.7k  RESISTOR  [0805]
R26  1K  RESISTOR  [0805]
R27  4.7K  RESISTOR  [0805]
R28  1K  RESISTOR  [0805]
R52  4.7K  RESISTOR  [0805]
R53  4.7K  RESISTOR  [0805]
R68  1K  RESISTOR  [0805]
R69  1K  RESISTOR  [0805]
R77  4.7K  RESISTOR  [0805]
R79  1K  RESISTOR  [0805]
R82  180  RESISTOR  [0805]
R83  180  RESISTOR  [0805]
R85  1K  RESISTOR  [0805]
R86  1K  RESISTOR  [0805]
R88  10K  RESISTOR  [0805]
R89  1K  RESISTOR  [0805]
R90  4.7K  RESISTOR  [0805]
R91  4.7K  RESISTOR  [0805]
R92  4.7K  RESISTOR  [0805]
R97  10K  RESISTOR  [0805]
R98  1K  RESISTOR  [0805]
R99  4.7K  RESISTOR  [0805]
R100  4.7K  RESISTOR  [0805]
R101  4.7K  RESISTOR  [0805]
R104  0  RESISTOR  [0805]
TP8  PTR1TP09R  [TP09R]
TP9  PTR1TP09R  [TP09R]
TP10  PTR1TP09R  [TP09R]
TP24  PTR1TP09R  [TP09R]
TP35  PTR1TP09R  [TP09R]
TP36  PTR1TP09R  [TP09R]
X8  TERMBLK3_5X2  [TERMBLK3_5X2]
X10  TERMBLK3_5X2  [TERMBLK3_5X2]
X11  TERMBLK3_5X2  [TERMBLK3_5X2]
X12  TERMBLK3_5X2  [TERMBLK3_5X2]
X15  TERMBLK3_5X2  [TERMBLK3_5X2]
X16  TERMBLK3_5X2  [TERMBLK3_5X2]
X17  TERMBLK3_5X2  [TERMBLK3_5X2]
X18  TERMBLK3_5X2  [TERMBLK3_5X2]
X19  TERMBLK3_5X2  [TERMBLK3_5X2]
X20  TERMBLK3_5X2  [TERMBLK3_5X2]
Y2  CRYSTALHC49UP  [HC49UP]

### Nets
+5V [5V_power]: C7.2 C23.2 C65.2 C66.2 C67.2 IC9.4(VCC) IC11.8(VCC) IC14.4(VCC) IC14.6(VCC) IC14.18(AVCC) IC17.4(VCC) JP4.1 JP7.3 JP7.4 P12.2 R4.2 R52.2 R53.2 R88.2 R97.2 ; also sheet 1,2,3,4,5,7,8
A0/6: IC11.3(DE) IC14.23(PC0(ADC0)) R9.1
A1/6: IC11.2(!RE) IC14.24(PC1(ADC1)) R4.1
A2/6: IC14.25(PC2(ADC2)) Q8.4(G) R100.2
A3/6: IC14.26(PC3(ADC3))
A6/6: IC14.19(ADC6) JP7.6
A7/6: IC14.22(ADC7) JP7.5
APWR [power]: DS23.C Q3.MB(D) X19.1
APWR1 [power]: DS29.C Q7.MB(D) X15.1
ATGND: R104.1
BPWR [power]: DS24.C Q1.MB(D) X17.1
BPWR1 [power]: DS30.C Q8.MB(D) X12.1
CPWR [power]: DS25.C Q5.MB(D) X16.1
CPWR1 [power]: DS31.C Q9.MB(D) X11.1
D2/6: IC9.6(CS) IC14.32(PD2(INT0)) R97.1
D3/6: IC14.1(PD3(INT1)) Q3.4(G) R90.2
D4/6: IC14.2(PD4(XCK/T0)) IC17.6(CS) R88.1
D5/6: IC14.9(PD5(T1)) Q7.4(G) R99.2
D6/6: IC14.10(PD6(AIN0)) Q4.4(G) R77.2
D7/6: IC14.11(PD7(AIN1)) Q9.4(G) R101.2
D8/6: IC14.12(PB0(ICP)) Q2.4(G) R27.2
D9/6: IC14.13(PB1(OC1A)) Q5.4(G) R92.2
D10/6: IC14.14(PB2(SS/OC1B)) Q1.4(G) R91.2
D11/6: IC14.15(PB3(MOSI/OC2)) P12.4
D12/6: IC14.16(PB4(MISO)) P12.1 R82.2 R83.2
D13/6: IC9.5(SCK) IC14.17(PB5(SCK)) IC17.5(SCK) P12.3 R79.2 TP8.TP
DPWR [power]: DS28.C Q4.MB(D) X10.1
DPWR1 [power]: DS22.C Q2.MB(D) X8.1
GND [power]: C7.1 C23.1 C46.1 C47.1 C48.1 C65.1 C66.1 C67.1 DS21.C IC11.5(GND) IC14.3(GND) IC14.5(AGND) IC14.21(GND) JP4.2 JP7.1 JP7.2 P12.6 Q1.1(S) Q1.2(S) Q1.3(S) Q2.1(S) Q2.2(S) Q2.3(S) Q3.1(S) Q3.2(S) Q3.3(S) Q4.1(S) Q4.2(S) Q4.3(S) Q5.1(S) Q5.2(S) Q5.3(S) Q7.1(S) Q7.2(S) Q7.3(S) Q8.1(S) Q8.2(S) Q8.3(S) Q9.1(S) Q9.2(S) Q9.3(S) R9.2 R27.1 R77.1 R90.1 R91.1 R92.1 R99.1 R100.1 R101.1 R104.2 ; also sheet 1,2,3,4,5,7,8
N$12: DS29.A R86.1
N$31: DS23.A R69.1
N$48: DS24.A R68.1
N$68: DS22.A R26.1
N$69: DS28.A R28.1
N$72: DS30.A R85.1
N$73: C46.2 IC14.7(PB6(XTAL1/TOSC1)) Y2.2
N$74: C47.2 IC14.8(PB7(XTAL2/TOSC2)) TP24.TP Y2.1
N$75: DS21.A R79.1
N$76: C48.2 IC14.20(AREF)
N$81: IC9.7(SO) R82.1 TP9.TP
N$83: IC17.7(SO) R83.1 TP10.TP
N$96: C22.1 IC9.3(T+) X20.2
N$97: C64.1 IC17.3(T+) X18.2
N$98: DS25.A R89.1
N$99: DS31.A R98.1
RESET: IC14.29(PC6(/RESET)) P12.5 ; also sheet 1
RS485A: IC11.6(A) R1.1 ; also sheet 2
RS485B: IC11.7(B) R1.2 ; also sheet 2
RX/6: IC11.1(R) IC14.30(PD0(RXD)) ; also sheet 1
SCL/6: IC14.28(PC5(ADC5/SCL)) JP4.4 R53.1 TP35.TP
SDA/6: IC14.27(PC4(ADC4/SDA)) JP4.3 R52.1 TP36.TP
TGND: C22.2 C64.2 IC9.1(GND) IC9.2(T-) IC17.1(GND) IC17.2(T-) X18.1 X20.1
TX/6: IC11.4(D) IC14.31(PD1(TXD)) ; also sheet 1
VC+ [12V_power]: R26.2 R28.2 R68.2 R69.2 R85.2 R86.2 R89.2 R98.2 X8.2 X10.2 X11.2 X12.2 X15.2 X16.2 X17.2 X19.2 ; also sheet 1,2,3,4,5,7,8

### Notes on the sheet
- wiki.makerbot.com/ec3
- Extruder Controller v3.5
- THERMOCOUPLES | ICSP
- MOSFETS
- . | .
- . | .
- . | .
- . | .
- . | .
- . | .
- Note: Use analog GND on pins 1 and 2 | .
- E | F | G | H
- . | .
- . | .
- . | .
- . | .
- . | .
- INDICATORS
- ARDUINO
- A | B | C | D
- I2C
- EXTRA ANALOG | RS485

## Sheet 7 of 8
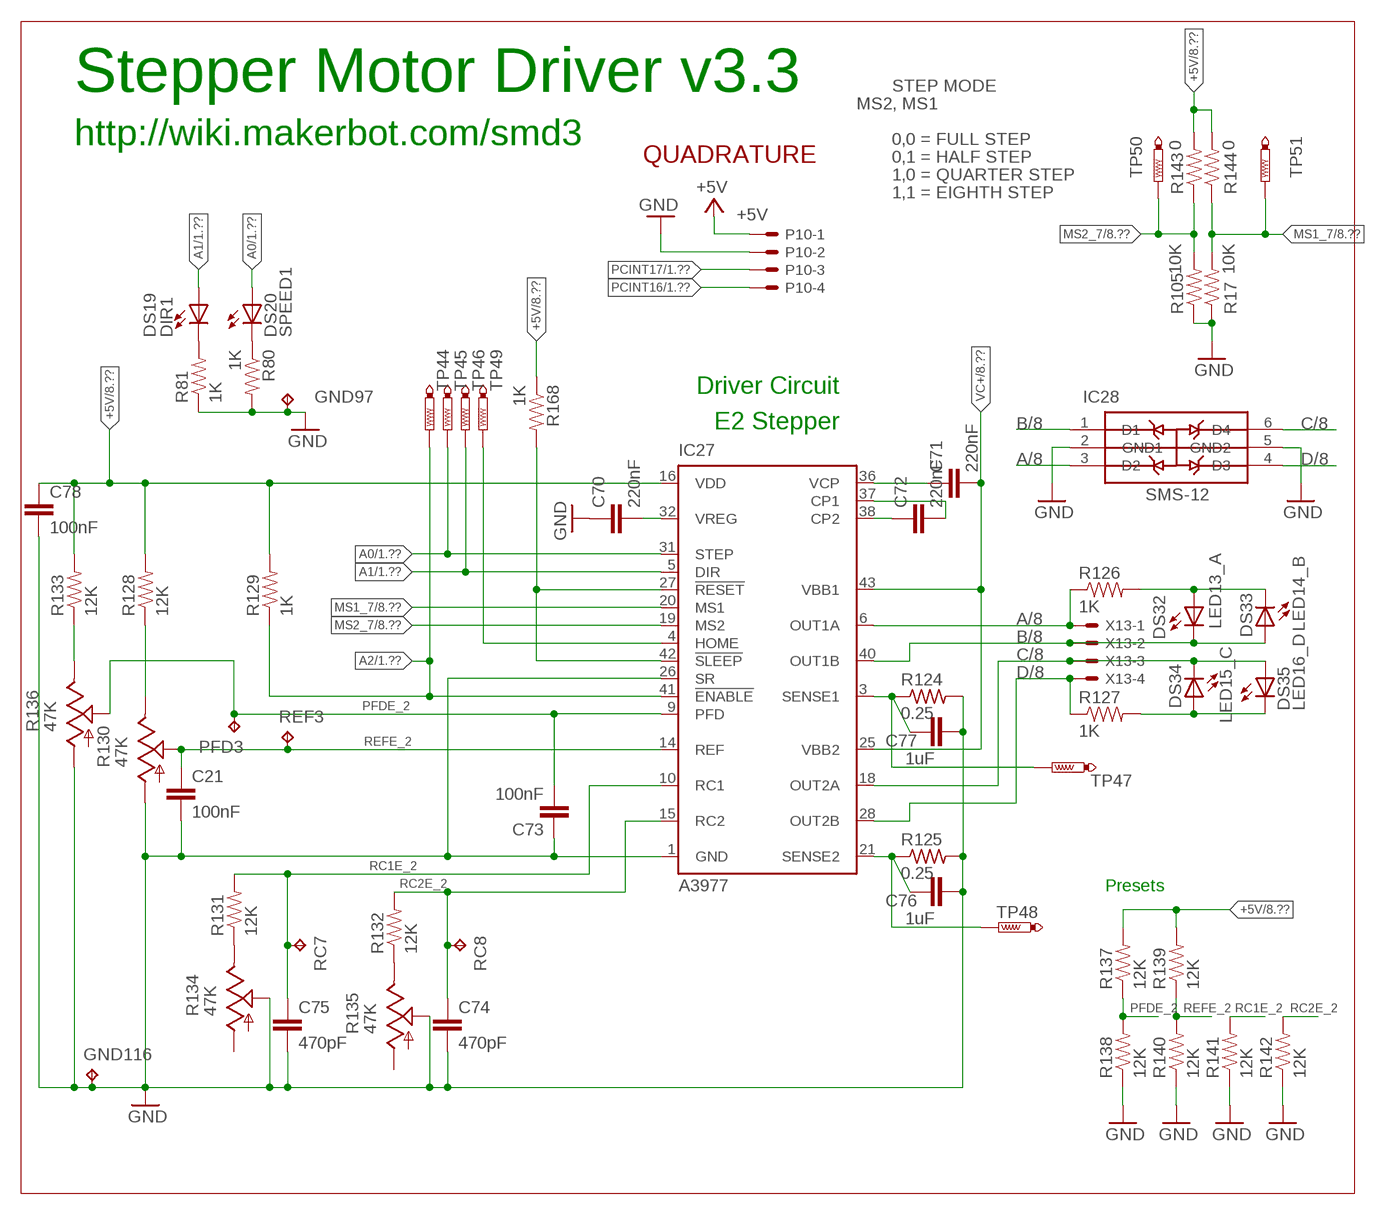
[diagram p6: schematic, sheet 7]

### Parts
C21  100nF  CAP0805  [0805]
C70  220nF  CAP0805  [0805]
C71  220nF  CAP0805  [0805]
C72  220nF  CAP0805  [0805]
C73  100nF  CAP0805  [0805]
C74  470pF  CAP0805  [0805]
C75  470pF  CAP0805  [0805]
C76  1uF  CAP0805  [0805]
C77  1uF  CAP0805  [0805]
C78  100nF  CAP0805  [0805]
DS19  DIR1  LED0805  [LED-0805]
DS20  SPEED1  LED0805  [LED-0805]
DS32  LED13_A  LED0805  [LED-0805]
DS33  LED14_B  LED0805  [LED-0805]
DS34  LED15_C  LED0805  [LED-0805]
DS35  LED16_D  LED0805  [LED-0805]
GND97  TPPAD1-13  [P1-13]
GND116  TPPAD1-13  [P1-13]
IC27  A3977  [PLCC44]
IC28  SMS-12  TVS-DIODE-ARRAY  [SOT23-6]
P10  C-GRID-04-70543  [70543-04]
PFD3  TPPAD1-13  [P1-13]
R17  10K  RESISTOR  [0805]
R80  1K  RESISTOR  [0805]
R81  1K  RESISTOR  [0805]
R105  10K  RESISTOR  [0805]
R124  0.25  R-US_R2512  [R2512]
R125  0.25  R-US_R2512  [R2512]
R126  1K  RESISTOR  [0805]
R127  1K  RESISTOR  [0805]
R128  12K  RESISTOR  [0805]
R129  1K  RESISTOR  [0805]
R130  47K  TRIM_US-B25P  [B25P]
R131  12K  RESISTOR  [0805]
R132  12K  RESISTOR  [0805]
R133  12K  RESISTOR  [0805]
R134  47K  TRIM_US-B25P  [B25P]
R135  47K  TRIM_US-B25P  [B25P]
R136  47K  TRIM_US-B25P  [B25P]
R137  12K  RESISTOR  [0805]
R138  12K  RESISTOR  [0805]
R139  12K  RESISTOR  [0805]
R140  12K  RESISTOR  [0805]
R141  12K  RESISTOR  [0805]
R142  12K  RESISTOR  [0805]
R143  0  RESISTOR  [0805]
R144  0  RESISTOR  [0805]
R168  1K  RESISTOR  [0805]
RC7  TPPAD1-13  [P1-13]
RC8  TPPAD1-13  [P1-13]
REF3  TPPAD1-13  [P1-13]
TP44  PTR1TP09R  [TP09R]
TP45  PTR1TP09R  [TP09R]
TP46  PTR1TP09R  [TP09R]
TP47  PTR1TP09R  [TP09R]
TP48  PTR1TP09R  [TP09R]
TP49  PTR1TP09R  [TP09R]
TP50  PTR1TP09R  [TP09R]
TP51  PTR1TP09R  [TP09R]
X13  KK-156-4  [KK-156-4]

### Nets
+5V [5V_power]: C78.1 IC27.16(VDD) P10.1 R128.2 R129.2 R133.2 R137.2 R139.2 R143.2 R144.2 R168.1 ; also sheet 1,2,3,4,5,6,8
A0: DS20.A IC27.31(STEP) TP45.TP ; also sheet 1
A1: DS19.A IC27.5(DIR) TP46.TP ; also sheet 1
A2: IC27.41(!ENABLE) R129.1 TP44.TP ; also sheet 1
A/8 [power]: IC27.6(OUT1A) IC28.3(D2) R126.1 X13.1
B/8 [power]: DS32.C DS33.A IC27.40(OUT1B) IC28.1(D1) X13.2
C/8 [power]: DS34.C DS35.A IC27.18(OUT2A) IC28.6(D4) X13.3
D/8 [power]: IC27.28(OUT2B) IC28.4(D3) R127.1 X13.4
GND [power]: C21.2 C70.1 C73.1 C74.2 C75.2 C76.2 C77.2 C78.2 GND97.TP GND116.TP IC27.1(GND) IC27.26(SR) IC28.2(GND1) IC28.5(GND2) P10.2 R17.1 R80.2 R81.1 R105.1 R124.2 R125.2 R130.A R134.S R135.S R136.A R138.1 R140.1 R141.1 R142.1 ; also sheet 1,2,3,4,5,6,8
MS1_7: IC27.20(MS1) R17.2 R144.1 TP51.TP ; also sheet 8
MS2_7: IC27.19(MS2) R105.2 R143.1 TP50.TP ; also sheet 8
N$9 [5V_power]: IC27.27(!RESET) IC27.42(!SLEEP) R168.2
N$13: DS32.A DS33.C R126.2
N$24: DS34.A DS35.C R127.2
N$27: R128.1 R130.E
N$28: C70.2 IC27.32(VREG)
N$30: C72.1 IC27.38(CP2)
N$41: C72.2 IC27.37(CP1)
N$44: C71.1 IC27.36(VCP)
N$45 [power]: C77.1 IC27.3(SENSE1) R124.1 TP47.TP
N$47 [power]: C76.1 IC27.21(SENSE2) R125.1 TP48.TP
N$62: R131.1 R134.E
N$65: R132.1 R135.E
N$66: R133.1 R136.E
N$79: DS20.C R80.1
N$80: DS19.C R81.2
N$91: IC27.4(HOME) TP49.TP
PCINT16: P10.4 ; also sheet 1
PCINT17: P10.3 ; also sheet 1
PFDE_2: C73.2 IC27.9(PFD) PFD3.TP R136.S R137.1 R138.2
RC1E_2: C75.1 IC27.10(RC1) R131.2 R141.2 RC7.TP
RC2E_2: C74.1 IC27.15(RC2) R132.2 R142.2 RC8.TP
REFE_2: C21.1 IC27.14(REF) R130.S R139.1 R140.2 REF3.TP
VC+ [12V_power]: C71.2 IC27.25(VBB2) IC27.43(VBB1) ; also sheet 1,2,3,4,5,6,8
Unconnected: R134.A R135.A

### Notes on the sheet
- Stepper Motor Driver v3.3 | STEP MODE
- MS2, MS1
- http://wiki.makerbot.com/smd3 | 0,0 = FULL STEP
- QUADRATURE | 0,1 = HALF STEP
- 1,0 = QUARTER STEP
- 1,1 = EIGHTH STEP
- Driver Circuit
- E2 Stepper
- Presets

## Sheet 8 of 8
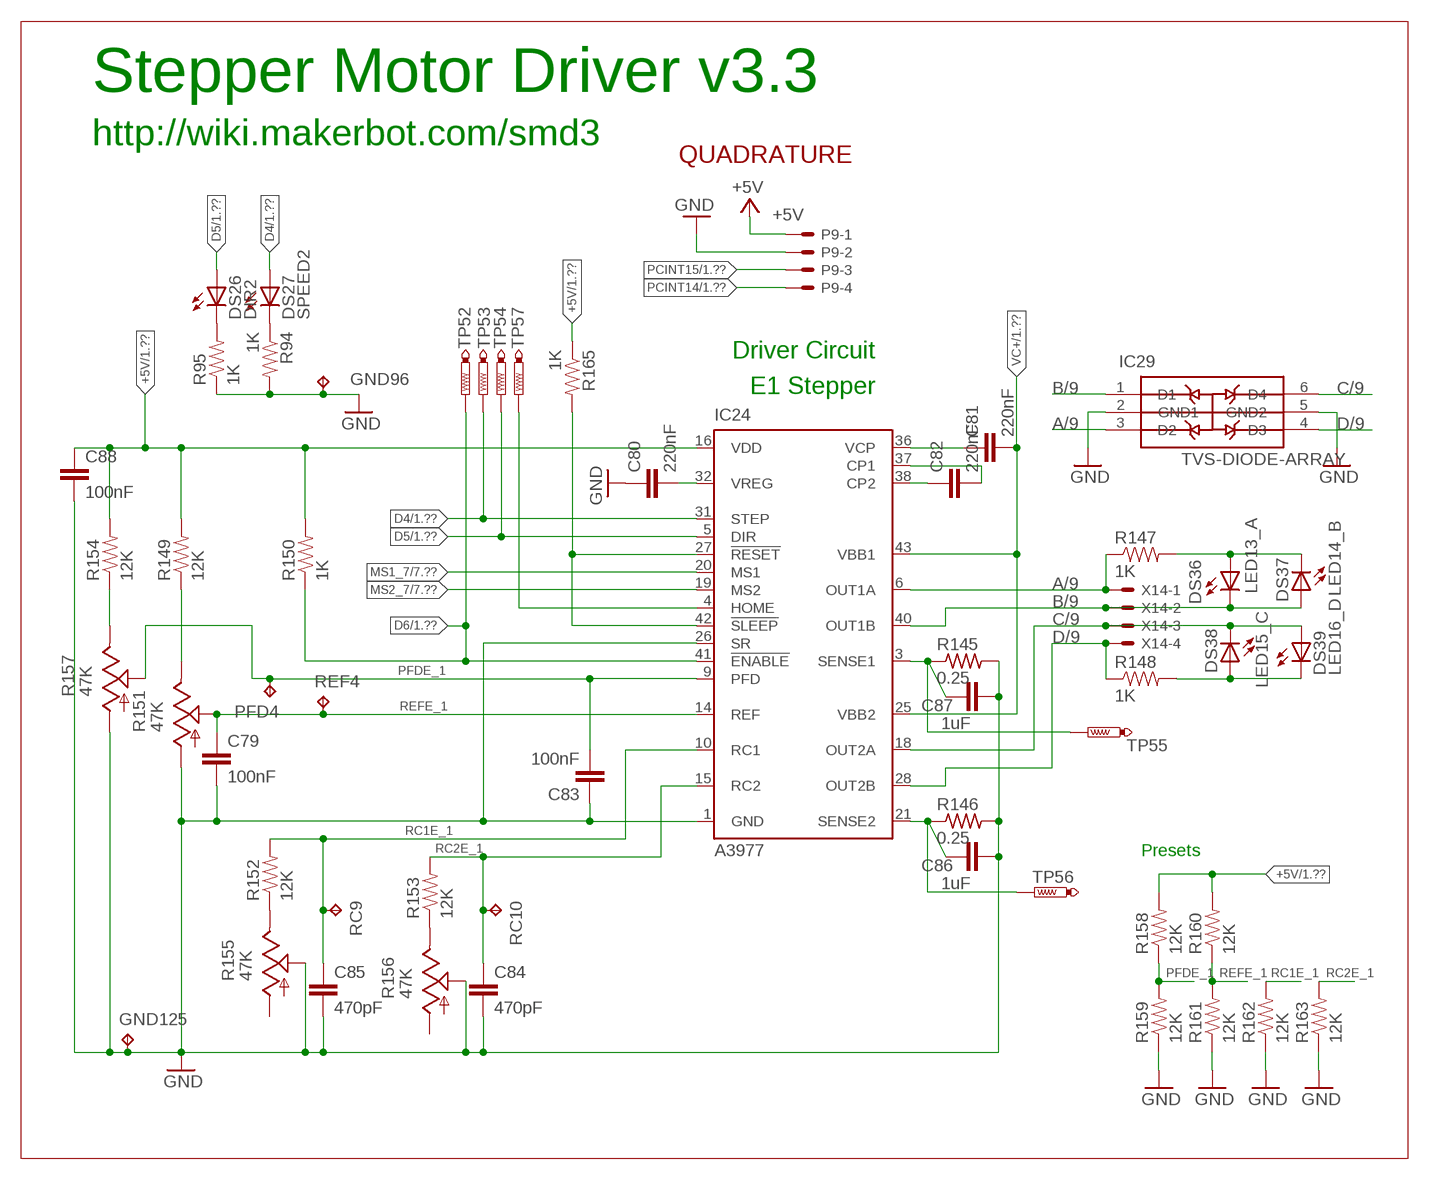
[diagram p7: schematic, sheet 8]

### Parts
C79  100nF  CAP0805  [0805]
C80  220nF  CAP0805  [0805]
C81  220nF  CAP0805  [0805]
C82  220nF  CAP0805  [0805]
C83  100nF  CAP0805  [0805]
C84  470pF  CAP0805  [0805]
C85  470pF  CAP0805  [0805]
C86  1uF  CAP0805  [0805]
C87  1uF  CAP0805  [0805]
C88  100nF  CAP0805  [0805]
DS26  DIR2  LED0805  [LED-0805]
DS27  SPEED2  LED0805  [LED-0805]
DS36  LED13_A  LED0805  [LED-0805]
DS37  LED14_B  LED0805  [LED-0805]
DS38  LED15_C  LED0805  [LED-0805]
DS39  LED16_D  LED0805  [LED-0805]
GND96  TPPAD1-13  [P1-13]
GND125  TPPAD1-13  [P1-13]
IC24  A3977  [PLCC44]
IC29  TVS-DIODE-ARRAY  [SOT23-6]
P9  C-GRID-04-70543  [70543-04]
PFD4  TPPAD1-13  [P1-13]
R94  1K  RESISTOR  [0805]
R95  1K  RESISTOR  [0805]
R145  0.25  R-US_R2512  [R2512]
R146  0.25  R-US_R2512  [R2512]
R147  1K  RESISTOR  [0805]
R148  1K  RESISTOR  [0805]
R149  12K  RESISTOR  [0805]
R150  1K  RESISTOR  [0805]
R151  47K  TRIM_US-B25P  [B25P]
R152  12K  RESISTOR  [0805]
R153  12K  RESISTOR  [0805]
R154  12K  RESISTOR  [0805]
R155  47K  TRIM_US-B25P  [B25P]
R156  47K  TRIM_US-B25P  [B25P]
R157  47K  TRIM_US-B25P  [B25P]
R158  12K  RESISTOR  [0805]
R159  12K  RESISTOR  [0805]
R160  12K  RESISTOR  [0805]
R161  12K  RESISTOR  [0805]
R162  12K  RESISTOR  [0805]
R163  12K  RESISTOR  [0805]
R165  1K  RESISTOR  [0805]
RC9  TPPAD1-13  [P1-13]
RC10  TPPAD1-13  [P1-13]
REF4  TPPAD1-13  [P1-13]
TP52  PTR1TP09R  [TP09R]
TP53  PTR1TP09R  [TP09R]
TP54  PTR1TP09R  [TP09R]
TP55  PTR1TP09R  [TP09R]
TP56  PTR1TP09R  [TP09R]
TP57  PTR1TP09R  [TP09R]
X14  KK-156-4  [KK-156-4]

### Nets
+5V [5V_power]: C88.1 IC24.16(VDD) P9.1 R149.2 R150.2 R154.2 R158.2 R160.2 R165.1 ; also sheet 1,2,3,4,5,6,7
A/9 [power]: IC24.6(OUT1A) IC29.3(D2) R147.1 X14.1
B/9 [power]: DS36.C DS37.A IC24.40(OUT1B) IC29.1(D1) X14.2
C/9 [power]: DS38.C DS39.A IC24.18(OUT2A) IC29.6(D4) X14.3
D4: DS27.A IC24.31(STEP) TP53.TP ; also sheet 1
D5: DS26.A IC24.5(DIR) TP54.TP ; also sheet 1
D6: IC24.41(!ENABLE) R150.1 TP52.TP ; also sheet 1
D/9 [power]: IC24.28(OUT2B) IC29.4(D3) R148.1 X14.4
GND [power]: C79.2 C80.1 C83.1 C84.2 C85.2 C86.2 C87.2 C88.2 GND96.TP GND125.TP IC24.1(GND) IC24.26(SR) IC29.2(GND1) IC29.5(GND2) P9.2 R94.2 R95.1 R145.2 R146.2 R151.A R155.S R156.S R157.A R159.1 R161.1 R162.1 R163.1 ; also sheet 1,2,3,4,5,6,7
MS1_7: IC24.20(MS1) ; also sheet 7
MS2_7: IC24.19(MS2) ; also sheet 7
N$2 [5V_power]: IC24.27(!RESET) IC24.42(!SLEEP) R165.2
N$92: DS36.A DS37.C R147.2
N$93: DS27.C R94.1
N$94: DS26.C R95.2
N$95: DS38.A DS39.C R148.2
N$102: R149.1 R151.E
N$103: C80.2 IC24.32(VREG)
N$104: C82.1 IC24.38(CP2)
N$105: C82.2 IC24.37(CP1)
N$106: C81.1 IC24.36(VCP)
N$107 [power]: C87.1 IC24.3(SENSE1) R145.1 TP55.TP
N$108 [power]: C86.1 IC24.21(SENSE2) R146.1 TP56.TP
N$109: R152.1 R155.E
N$110: R153.1 R156.E
N$111: R154.1 R157.E
N$112: IC24.4(HOME) TP57.TP
PCINT14: P9.4 ; also sheet 1
PCINT15: P9.3 ; also sheet 1
PFDE_1: C83.2 IC24.9(PFD) PFD4.TP R157.S R158.1 R159.2
RC1E_1: C85.1 IC24.10(RC1) R152.2 R162.2 RC9.TP
RC2E_1: C84.1 IC24.15(RC2) R153.2 R163.2 RC10.TP
REFE_1: C79.1 IC24.14(REF) R151.S R160.1 R161.2 REF4.TP
VC+ [12V_power]: C81.2 IC24.25(VBB2) IC24.43(VBB1) ; also sheet 1,2,3,4,5,6,7
Unconnected: R155.A R156.A

### Notes on the sheet
- Stepper Motor Driver v3.3
- http://wiki.makerbot.com/smd3
- QUADRATURE
- Driver Circuit
- E1 Stepper
- Presets

## Power pins joined to a net without a drawn wire
GND: IC8.2(GND) IC8.11(GND) IC8.12(GND) IC8.13(GND) IC8.22(GND) IC8.23(GND) IC8.24(GND) IC8.33(GND) IC8.34(GND) IC8.35(GND) IC8.44(GND) IC10.2(GND) IC10.11(GND) IC10.12(GND) IC10.13(GND) IC10.22(GND) IC10.23(GND) IC10.24(GND) IC10.33(GND) IC10.34(GND) IC10.35(GND) IC10.44(GND) IC12.2(GND) IC12.11(GND) IC12.12(GND) IC12.13(GND) IC12.22(GND) IC12.23(GND) IC12.24(GND) IC12.33(GND) IC12.34(GND) IC12.35(GND) IC12.44(GND) IC24.2(GND) IC24.11(GND) IC24.12(GND) IC24.13(GND) IC24.22(GND) IC24.23(GND) IC24.24(GND) IC24.33(GND) IC24.34(GND) IC24.35(GND) IC24.44(GND) IC27.2(GND) IC27.11(GND) IC27.12(GND) IC27.13(GND) IC27.22(GND) IC27.23(GND) IC27.24(GND) IC27.33(GND) IC27.34(GND) IC27.35(GND) IC27.44(GND)
VCC30: IC6.17(VCC30)

## Library data of the parts
C1 C15 = resistor:CPOL-EU: POLARIZED CAPACITOR, European symbol
C2-C14 C21-C32 C37-C48 C50-C58 C61 C63-C88 = SparkFun:CAP: Capacitor Standard 0603 ceramic capacitor, and 0.1" leaded capacitor.
DS1-DS39 = SparkFun:LED: LEDs Standard schematic elements and footprints for 5mm, 3mm, 1206, and 0603 sized LEDs. 5mm - Spark Fun Electronics SKU : COM-00529 (and others)
F1 = rcl:L-EU: INDUCTOR, European symbol
GND GND53 GND58 GND96 GND97 GND116 GND125 PFD PFD1-PFD4 RC1-RC10 REF REF1-REF4 = testpad:TP: Test pad
IC1 IC11 = reprap:SN75176A
IC2 = atmel-2005:ATMEGA*: MICROCONTROLLER 64/128/256 Kbytes FLASH 4 Kbytes EEPROM 8 Kbytes SRAM 86 General Purpose I/O pins 12-channels16-bit PWM 4 x Serial USARTs 16-channels 10-bit A/D
IC3 = 74xx-little-us:74*1G32: 2-input OR gate
IC6 = SmartPrj:FT232RL
IC8 IC10 IC12 IC24 IC27 = linear:A3977: MICROSTEPPING DMOS DRIVER WITH TRANSLATOR Source: http://allegromicro.com/datafile/3977.pdf
IC9 IC17 = reprap:MAX6675: Thermocouple amplifier and A to D converter
IC14 = SparkFun:ATMEGA168
IC15 = 74xx-little-us:74*1G19: 1 to 2 Demultiplexer
IC20 = 74xx-little-us:74*2G157: 2-1 MUX
IC21-IC23 IC28 IC29 = reprap:TVS-DIODE-ARRAY: Transient Voltage Protection Diode Array
J1 = con-amp:556416-1: AMP connector
JP2 = pinhead:PINHD-1X2: PIN HEADER
JP4 = pinhead:PINHD-1X4: PIN HEADER
JP7 = pinhead:PINHD-2X3: PIN HEADER
P1-P7 P9 P10 P13-P15 = con-molex:C-GRID-04: CONNECTOR wire to board 2.54 mm (0.100") pitch header
P8 = con-harting-ml:ML20: HARTING
P11 P12 = con-harting-ml:ML6: HARTING
Q1-Q5 Q7-Q9 = transistor-power:PH7030L: N-channel TrenchMOS (TM) logic level FET Source: http://www.nxp.com/acrobat_download/datasheets/PH7030L_4.pdf
R1 R2 R4-R28 R31-R34 R36-R40 R44 R47-R50 R52-R56 R60 R63-R66 R68-R72 R76-R92 R94 R95 R97-R101 R104-R123 R126-R129 R131-R133 R137-R144 R147-R150 R152-R154 R158-R163 R165-R169 = SparkFun:RESISTOR: Resistor Basic schematic elements and footprints for 0603, 1206, and PTH 1/10th watt (small) resistors.
R3 = resistor-power:R: Power Resitor
R29 R30 R45 R46 R61 R62 R124 R125 R145 R146 = rcl:R-US_: RESISTOR, American symbol
R35 R41-R43 R51 R57-R59 R67 R73-R75 R130 R134-R136 R151 R155-R157 = reprap:TRIM_US-: POTENTIOMETER
S1 = switch-omron:31-XX: OMRON SWITCH
SW1 = special:SW_DIP-1: DIP SWITCH
TP1-TP7 TP12 TP13 TP60 TP61 = testpad:TPSQ: Test pad
TP8-TP10 TP14-TP24 TP26-TP30 TP33-TP36 TP41-TP59 = testpad:PTR1: TEST PIN
U1 = reprap:PIEZO12MM: Piezo electric buzzer, 12 mm square SMD
U$3 U$8 U$9 = SmartPrj:FIDUCIALMOUNT
U$10 = SmartPrj:CE
U$13 = reprap:SDCARD
X1 = con-molex:5566-20: Mini FIT connector 20 pol ATX PC-Motherboard Power connector Source: http://www.molex.com
X2 = con-thomas-betts:9090-4: Disk Drive Power four position Source: Thomas & Betts Electronic Interconnects Eiropean Edition 1998
X3 = jumper:JP4E: JUMPER
X4 = SmartPrj:PN61729: BERG USB connector
X5-X7 X13 X14 = con-molex:KK-156-4: KK 156 HEADER Source: http://www.molex.com/pdm_docs/sd/026604100_sd.pdf
X8 X10-X12 X15-X20 = con-phoenix-508:TERMBLK3_5X2
X9 = con-molex:5566-4: Mini FIT connector 4 pol Source: http://www.molex.com
Y1 Y2 = crystal:CRYSTAL: CRYSTAL

## Net classes
0 default: width 0.152 mm, drill 0.406 mm, clearance 0.203 mm
1 power: width 0.61 mm, drill 0.584 mm, clearance 0.203 mm
2 gnd: width 0.305 mm, drill 0.584 mm, clearance 0.203 mm
3 usbvcc: width 0.508 mm, drill 0.584 mm, clearance 0.203 mm
4 5V_power: width 0.406 mm, drill 0.584 mm, clearance 0.203 mm
5 12V_power: width 1.524 mm, drill 0.584 mm, clearance 0.203 mm